# Altium project MainBoard.PrjPCB
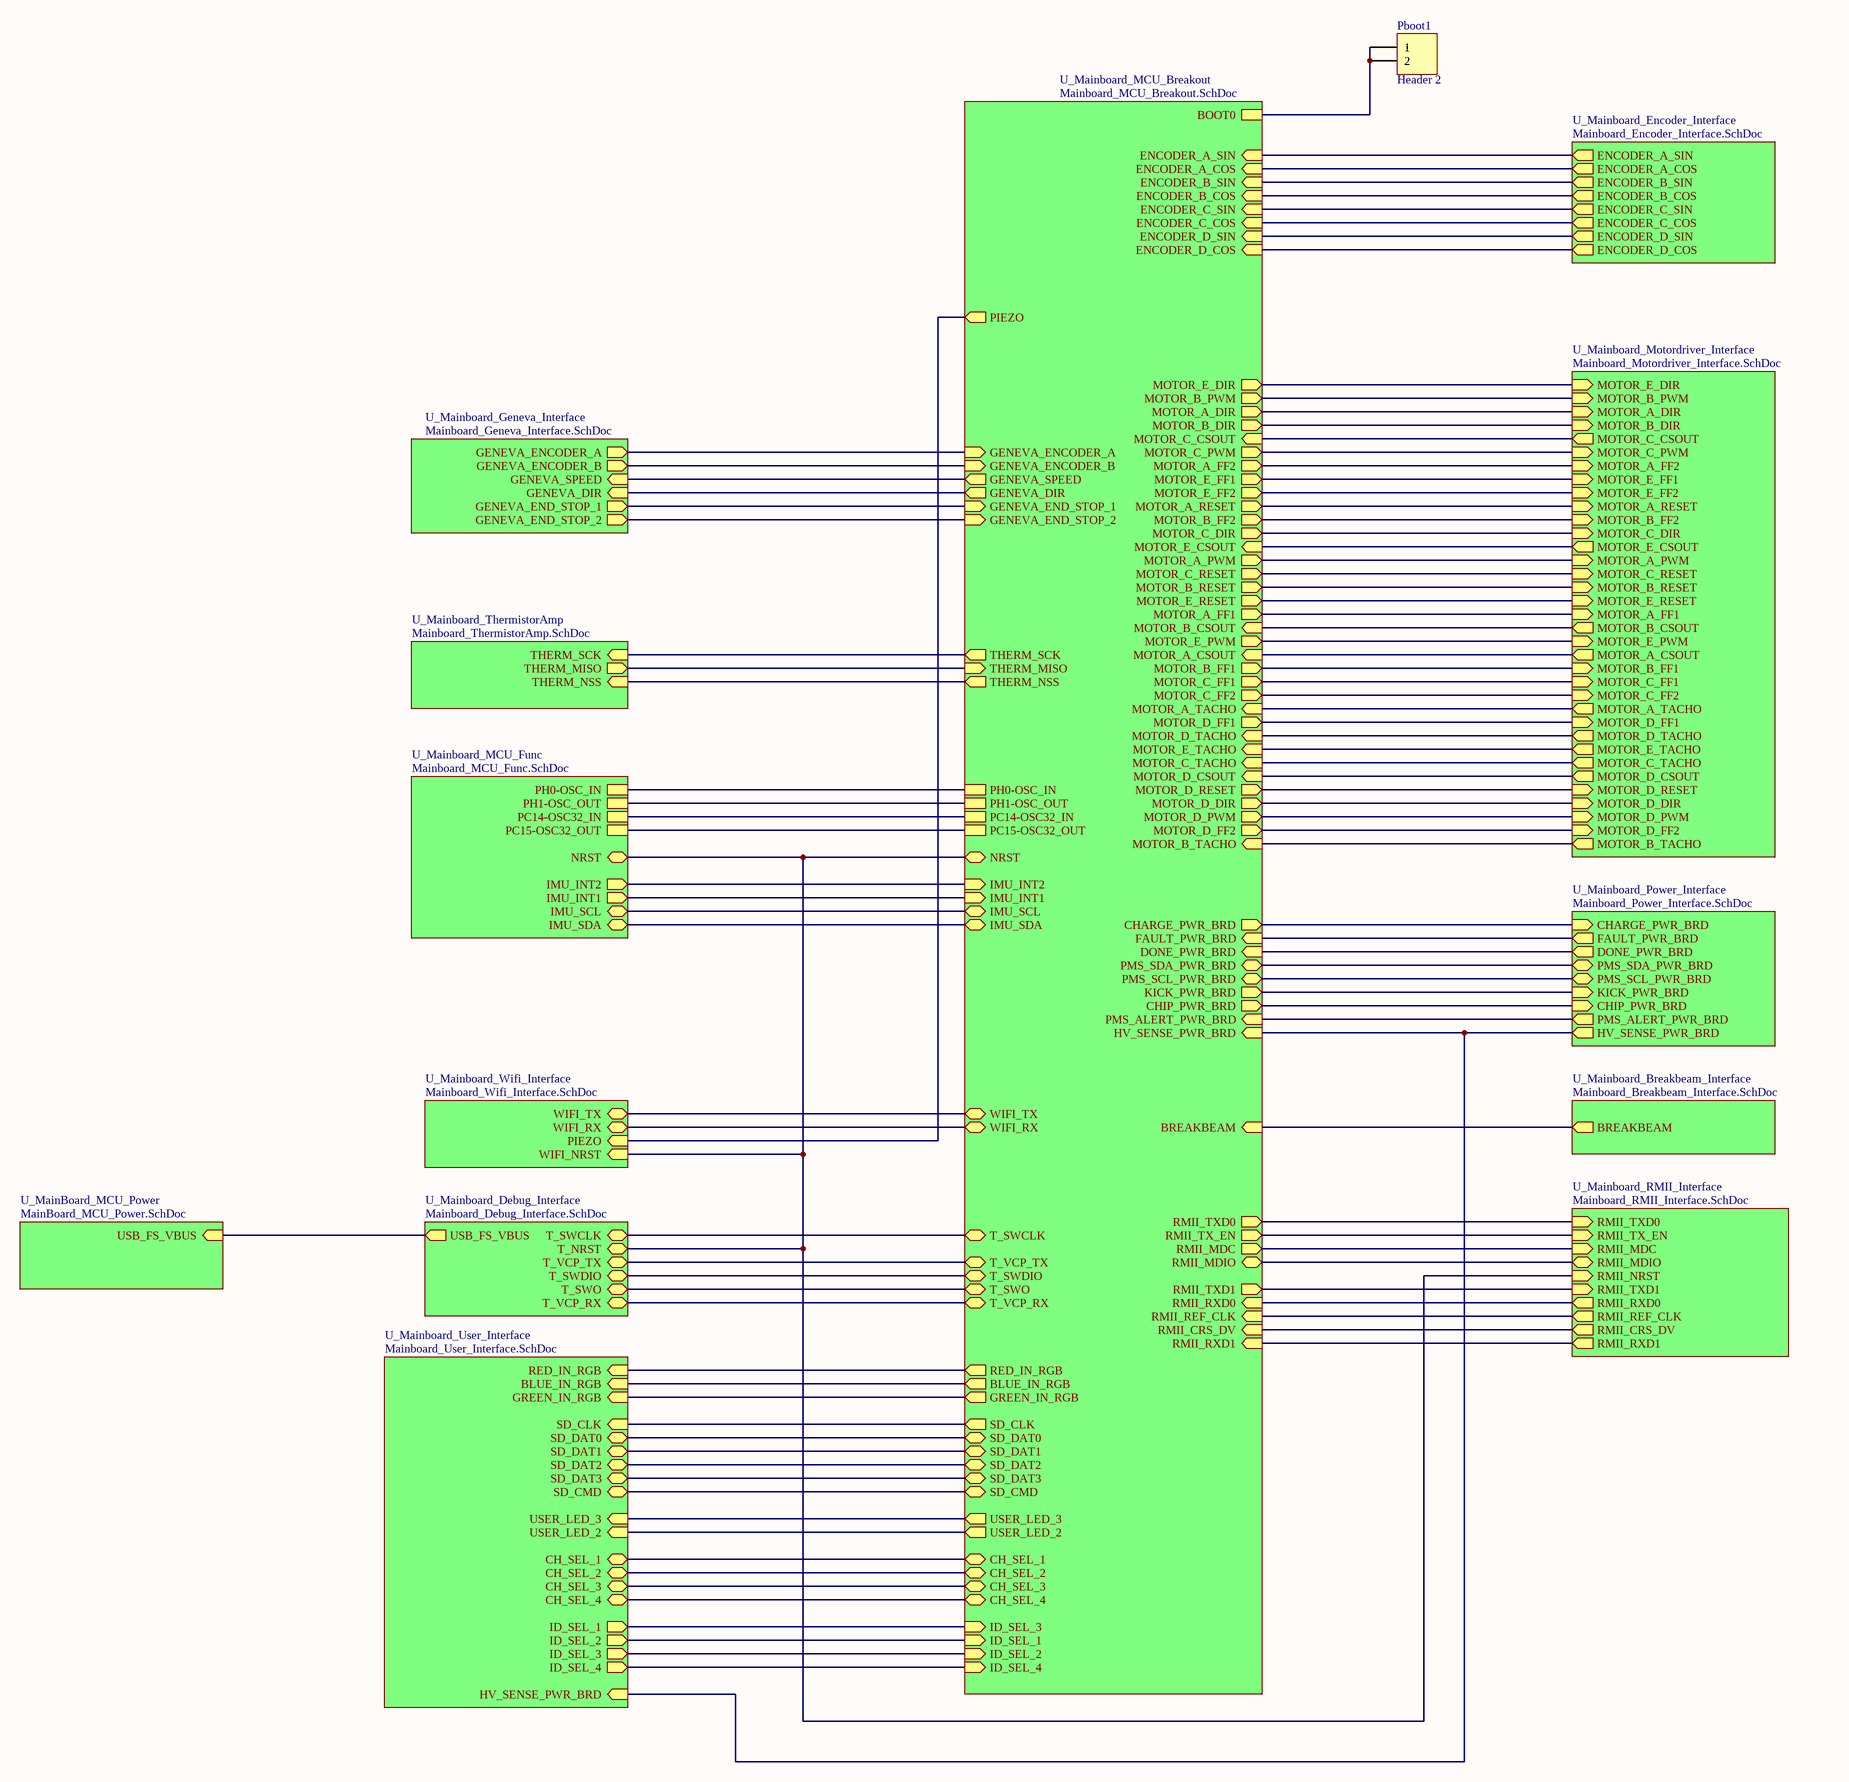
[diagram p0: MainBoard_Top.SchDoc]
4 sheets, 129 parts. Net scope: hierarchical (ports join the sheet entries above them; power ports are global).
Board file: MainBoard_Layout_V2.PcbDoc
Sheets:
  MainBoard_Top.SchDoc
    U_Mainboard_Encoder_Interface = Mainboard_Encoder_Interface.SchDoc
    U_Mainboard_RMII_Interface = Mainboard_RMII_Interface.SchDoc
    U_Mainboard_MCU_Breakout = Mainboard_MCU_Breakout.SchDoc

## Sheet MainBoard_Top.SchDoc
size C

### Parts
Pboot1  Header 2  [HDR1X2]

### Sub-sheets
U_Mainboard_Breakbeam_Interface = Mainboard_Breakbeam_Interface.SchDoc (file not in this document): BREAKBEAM (out)
U_Mainboard_Debug_Interface = Mainboard_Debug_Interface.SchDoc (file not in this document): USB_FS_VBUS (out), T_SWCLK (bidir), T_NRST (bidir), T_VCP_TX (bidir), T_SWDIO (bidir), T_SWO (bidir), T_VCP_RX (bidir)
U_Mainboard_Encoder_Interface = Mainboard_Encoder_Interface.SchDoc: ENCODER_A_SIN (out), ENCODER_B_COS (out), ENCODER_C_COS (out), ENCODER_A_COS (out), ENCODER_D_SIN (out), ENCODER_D_COS (out), ENCODER_B_SIN (out), ENCODER_C_SIN (out)
U_Mainboard_Geneva_Interface = Mainboard_Geneva_Interface.SchDoc (file not in this document): GENEVA_SPEED (in), GENEVA_ENCODER_A (out), GENEVA_ENCODER_B (out), GENEVA_DIR (in), GENEVA_END_STOP_1 (out), GENEVA_END_STOP_2 (out)
U_Mainboard_MCU_Breakout = Mainboard_MCU_Breakout.SchDoc: BOOT0, T_SWCLK (bidir), T_VCP_TX (bidir), T_SWDIO (bidir), T_SWO (bidir), T_VCP_RX (bidir), RED_IN_RGB (out), BLUE_IN_RGB (out), GREEN_IN_RGB (out), SD_CLK (out), SD_DAT0 (bidir), SD_DAT1 (bidir), SD_DAT2 (bidir), SD_DAT3 (bidir), SD_CMD (bidir), CH_SEL_1 (bidir), CH_SEL_2 (bidir), CH_SEL_3 (bidir), CH_SEL_4 (bidir), ENCODER_A_SIN (in), ENCODER_A_COS (in), ENCODER_B_SIN (in), ENCODER_B_COS (in), ENCODER_C_SIN (in), ENCODER_C_COS (in), ENCODER_D_SIN (in), ENCODER_D_COS (in), USER_LED_3 (out), USER_LED_2 (out), PC15-OSC32_OUT, PC14-OSC32_IN, PH1-OSC_OUT, NRST (bidir), PH0-OSC_IN, IMU_INT2 (in), IMU_INT1 (in), BREAKBEAM (in), RMII_TXD0 (out), RMII_TX_EN (out), RMII_MDC (out), RMII_MDIO (bidir), RMII_TXD1 (out), RMII_RXD0 (in), RMII_REF_CLK (in), RMII_CRS_DV (in), RMII_RXD1 (in), HV_SENSE_PWR_BRD (in), PMS_ALERT_PWR_BRD (in), CHIP_PWR_BRD (out), KICK_PWR_BRD (out), PMS_SCL_PWR_BRD (bidir), PMS_SDA_PWR_BRD (bidir), DONE_PWR_BRD (in), FAULT_PWR_BRD (in), CHARGE_PWR_BRD (out), IMU_SDA (bidir), IMU_SCL (bidir), THERM_NSS (out), THERM_MISO (in), THERM_SCK (out), WIFI_RX (bidir), WIFI_TX (bidir), ID_SEL_3 (in), ID_SEL_1 (in), ID_SEL_2 (in), ID_SEL_4 (in), MOTOR_E_DIR (out), MOTOR_B_PWM (out), MOTOR_A_DIR (out), MOTOR_B_DIR (out), MOTOR_C_CSOUT (in), MOTOR_C_PWM (out), MOTOR_A_FF2 (out), MOTOR_E_FF1 (out), MOTOR_E_FF2 (out), MOTOR_A_RESET (out), MOTOR_B_FF2 (out), MOTOR_C_DIR (out), MOTOR_E_CSOUT (in), MOTOR_A_PWM (out), MOTOR_C_RESET (out), MOTOR_B_RESET (out), MOTOR_E_RESET (out), MOTOR_A_FF1 (out), MOTOR_B_CSOUT (in), MOTOR_E_PWM (out), MOTOR_A_CSOUT (in), MOTOR_B_FF1 (out), MOTOR_C_FF1 (out), MOTOR_C_FF2 (out), MOTOR_A_TACHO (in), MOTOR_D_FF1 (out), MOTOR_D_TACHO (in), MOTOR_E_TACHO (in), MOTOR_C_TACHO (in), MOTOR_D_CSOUT (in), MOTOR_D_RESET (out), MOTOR_D_DIR (out), MOTOR_D_PWM (out), MOTOR_D_FF2 (out), MOTOR_B_TACHO (in), GENEVA_ENCODER_B (in), GENEVA_ENCODER_A (in), GENEVA_SPEED (out), PIEZO (out), GENEVA_DIR (out), GENEVA_END_STOP_2 (in), GENEVA_END_STOP_1 (in)
U_Mainboard_MCU_Func = Mainboard_MCU_Func.SchDoc (file not in this document): NRST (bidir), IMU_SCL (bidir), IMU_SDA (bidir), IMU_INT1 (out), IMU_INT2 (out), PH0-OSC_IN, PH1-OSC_OUT, PC14-OSC32_IN, PC15-OSC32_OUT
U_MainBoard_MCU_Power = MainBoard_MCU_Power.SchDoc (file not in this document): USB_FS_VBUS (in)
U_Mainboard_Motordriver_Interface = Mainboard_Motordriver_Interface.SchDoc (file not in this document): MOTOR_E_DIR (in), MOTOR_B_PWM (in), MOTOR_A_DIR (in), MOTOR_B_DIR (in), MOTOR_C_CSOUT (out), MOTOR_C_PWM (in), MOTOR_A_FF2 (in), MOTOR_E_FF1 (in), MOTOR_E_FF2 (in), MOTOR_A_RESET (in), MOTOR_B_FF2 (in), MOTOR_C_DIR (in), MOTOR_E_CSOUT (out), MOTOR_A_PWM (in), MOTOR_C_RESET (in), MOTOR_B_RESET (in), MOTOR_E_RESET (in), MOTOR_A_FF1 (in), MOTOR_B_CSOUT (out), MOTOR_E_PWM (in), MOTOR_A_CSOUT (out), MOTOR_B_FF1 (in), MOTOR_C_FF1 (in), MOTOR_C_FF2 (in), MOTOR_A_TACHO (out), MOTOR_D_FF1 (in), MOTOR_D_TACHO (out), MOTOR_E_TACHO (out), MOTOR_C_TACHO (out), MOTOR_D_CSOUT (out), MOTOR_D_RESET (in), MOTOR_D_DIR (in), MOTOR_D_PWM (in), MOTOR_D_FF2 (in), MOTOR_B_TACHO (out)
U_Mainboard_Power_Interface = Mainboard_Power_Interface.SchDoc (file not in this document): CHARGE_PWR_BRD (in), FAULT_PWR_BRD (out), DONE_PWR_BRD (out), PMS_SDA_PWR_BRD (bidir), PMS_SCL_PWR_BRD (bidir), KICK_PWR_BRD (in), CHIP_PWR_BRD (in), PMS_ALERT_PWR_BRD (out), HV_SENSE_PWR_BRD (out)
U_Mainboard_RMII_Interface = Mainboard_RMII_Interface.SchDoc: RMII_TXD0 (in), RMII_TX_EN (in), RMII_RXD0 (out), RMII_REF_CLK (out), RMII_CRS_DV (out), RMII_MDC (in), RMII_MDIO (bidir), RMII_NRST (in), RMII_TXD1 (in), RMII_RXD1 (out)
U_Mainboard_ThermistorAmp = Mainboard_ThermistorAmp.SchDoc (file not in this document): THERM_NSS (in), THERM_MISO (out), THERM_SCK (in)
U_Mainboard_User_Interface = Mainboard_User_Interface.SchDoc (file not in this document): RED_IN_RGB (in), BLUE_IN_RGB (in), GREEN_IN_RGB (in), SD_CLK (in), SD_DAT0 (bidir), SD_DAT1 (bidir), SD_DAT2 (bidir), SD_DAT3 (bidir), SD_CMD (bidir), USER_LED_3 (in), USER_LED_2 (in), CH_SEL_1 (bidir), CH_SEL_2 (bidir), CH_SEL_3 (bidir), CH_SEL_4 (bidir), ID_SEL_1 (out), ID_SEL_2 (out), ID_SEL_3 (out), ID_SEL_4 (out), HV_SENSE_PWR_BRD (in)
U_Mainboard_Wifi_Interface = Mainboard_Wifi_Interface.SchDoc (file not in this document): WIFI_NRST (in), WIFI_TX (bidir), WIFI_RX (bidir), PIEZO (in)

### Nets
COS_A: sheet U_Mainboard_Encoder_Interface/ENCODER_A_COS, sheet U_Mainboard_MCU_Breakout/ENCODER_A_COS
COS_B: sheet U_Mainboard_Encoder_Interface/ENCODER_B_COS, sheet U_Mainboard_MCU_Breakout/ENCODER_B_COS
COS_C: sheet U_Mainboard_Encoder_Interface/ENCODER_C_COS, sheet U_Mainboard_MCU_Breakout/ENCODER_C_COS
COS_D: sheet U_Mainboard_Encoder_Interface/ENCODER_D_COS, sheet U_Mainboard_MCU_Breakout/ENCODER_D_COS
RMII_MDIO: sheet U_Mainboard_RMII_Interface/RMII_MDIO, sheet U_Mainboard_MCU_Breakout/RMII_MDIO
RMII_REF_CLK: sheet U_Mainboard_RMII_Interface/RMII_REF_CLK, sheet U_Mainboard_MCU_Breakout/RMII_REF_CLK
RMII_TX_EN: sheet U_Mainboard_RMII_Interface/RMII_TX_EN, sheet U_Mainboard_MCU_Breakout/RMII_TX_EN
RMII_TXD0: sheet U_Mainboard_RMII_Interface/RMII_TXD0, sheet U_Mainboard_MCU_Breakout/RMII_TXD0
RMII_TXD1: sheet U_Mainboard_RMII_Interface/RMII_TXD1, sheet U_Mainboard_MCU_Breakout/RMII_TXD1
SIN_A: sheet U_Mainboard_Encoder_Interface/ENCODER_A_SIN, sheet U_Mainboard_MCU_Breakout/ENCODER_A_SIN
SIN_B: sheet U_Mainboard_Encoder_Interface/ENCODER_B_SIN, sheet U_Mainboard_MCU_Breakout/ENCODER_B_SIN
SIN_C: sheet U_Mainboard_Encoder_Interface/ENCODER_C_SIN, sheet U_Mainboard_MCU_Breakout/ENCODER_C_SIN
SIN_D: sheet U_Mainboard_Encoder_Interface/ENCODER_D_SIN, sheet U_Mainboard_MCU_Breakout/ENCODER_D_SIN
NetPboot1_1: Pboot1.1 Pboot1.2 ; sheet U_Mainboard_MCU_Breakout/BOOT0
NetR63_2: sheet U_Mainboard_RMII_Interface/RMII_RXD0, sheet U_Mainboard_MCU_Breakout/RMII_RXD0
NetR64_2: sheet U_Mainboard_RMII_Interface/RMII_RXD1, sheet U_Mainboard_MCU_Breakout/RMII_RXD1
NetR66_2: sheet U_Mainboard_RMII_Interface/RMII_CRS_DV, sheet U_Mainboard_MCU_Breakout/RMII_CRS_DV
NetU9_13: sheet U_Mainboard_RMII_Interface/RMII_MDC, sheet U_Mainboard_MCU_Breakout/RMII_MDC
NetU9_15: sheet U_Mainboard_RMII_Interface/RMII_NRST, sheet U_Mainboard_Wifi_Interface/WIFI_NRST, sheet U_Mainboard_Debug_Interface/T_NRST, sheet U_Mainboard_MCU_Breakout/NRST, sheet U_Mainboard_MCU_Func/NRST
NetU12_2: sheet U_Mainboard_Power_Interface/FAULT_PWR_BRD, sheet U_Mainboard_MCU_Breakout/FAULT_PWR_BRD
NetU12_3: sheet U_Mainboard_Power_Interface/DONE_PWR_BRD, sheet U_Mainboard_MCU_Breakout/DONE_PWR_BRD
NetU12_4: sheet U_Mainboard_Motordriver_Interface/MOTOR_E_FF1, sheet U_Mainboard_MCU_Breakout/MOTOR_E_FF1
NetU12_5: sheet U_Mainboard_MCU_Breakout/IMU_INT1, sheet U_Mainboard_MCU_Func/IMU_INT1
NetU12_7: sheet U_Mainboard_MCU_Breakout/IMU_INT2, sheet U_Mainboard_MCU_Func/IMU_INT2
NetU12_8: sheet U_Mainboard_MCU_Breakout/PC14-OSC32_IN, sheet U_Mainboard_MCU_Func/PC14-OSC32_IN
NetU12_9: sheet U_Mainboard_MCU_Breakout/PC15-OSC32_OUT, sheet U_Mainboard_MCU_Func/PC15-OSC32_OUT
NetU12_10: sheet U_Mainboard_MCU_Breakout/IMU_SDA, sheet U_Mainboard_MCU_Func/IMU_SDA
NetU12_11: sheet U_Mainboard_MCU_Breakout/IMU_SCL, sheet U_Mainboard_MCU_Func/IMU_SCL
NetU12_12: sheet U_Mainboard_Motordriver_Interface/MOTOR_E_RESET, sheet U_Mainboard_MCU_Breakout/MOTOR_E_RESET
NetU12_21: sheet U_Mainboard_Power_Interface/HV_SENSE_PWR_BRD, sheet U_Mainboard_MCU_Breakout/HV_SENSE_PWR_BRD, sheet U_Mainboard_User_Interface/HV_SENSE_PWR_BRD
NetU12_22: sheet U_Mainboard_Motordriver_Interface/MOTOR_E_FF2, sheet U_Mainboard_MCU_Breakout/MOTOR_E_FF2
NetU12_23: sheet U_Mainboard_MCU_Breakout/PH0-OSC_IN, sheet U_Mainboard_MCU_Func/PH0-OSC_IN
NetU12_24: sheet U_Mainboard_MCU_Breakout/PH1-OSC_OUT, sheet U_Mainboard_MCU_Func/PH1-OSC_OUT
NetU12_26: sheet U_Mainboard_Motordriver_Interface/MOTOR_E_CSOUT, sheet U_Mainboard_MCU_Breakout/MOTOR_E_CSOUT
NetU12_34: sheet U_Mainboard_Wifi_Interface/WIFI_TX, sheet U_Mainboard_MCU_Breakout/WIFI_TX
NetU12_37: sheet U_Mainboard_Motordriver_Interface/MOTOR_D_CSOUT, sheet U_Mainboard_MCU_Breakout/MOTOR_D_CSOUT
NetU12_40: sheet U_Mainboard_MCU_Breakout/THERM_NSS, sheet U_Mainboard_ThermistorAmp/THERM_NSS
NetU12_41: sheet U_Mainboard_MCU_Breakout/THERM_SCK, sheet U_Mainboard_ThermistorAmp/THERM_SCK
NetU12_42: sheet U_Mainboard_MCU_Breakout/THERM_MISO, sheet U_Mainboard_ThermistorAmp/THERM_MISO
NetU12_46: sheet U_Mainboard_Motordriver_Interface/MOTOR_C_CSOUT, sheet U_Mainboard_MCU_Breakout/MOTOR_C_CSOUT
NetU12_47: sheet U_Mainboard_Motordriver_Interface/MOTOR_E_TACHO, sheet U_Mainboard_MCU_Breakout/MOTOR_E_TACHO
NetU12_48: sheet U_Mainboard_Motordriver_Interface/MOTOR_D_RESET, sheet U_Mainboard_MCU_Breakout/MOTOR_D_RESET
NetU12_49: sheet U_Mainboard_Motordriver_Interface/MOTOR_B_CSOUT, sheet U_Mainboard_MCU_Breakout/MOTOR_B_CSOUT
NetU12_50: sheet U_Mainboard_Motordriver_Interface/MOTOR_A_CSOUT, sheet U_Mainboard_MCU_Breakout/MOTOR_A_CSOUT
NetU12_53: sheet U_Mainboard_MCU_Breakout/RED_IN_RGB, sheet U_Mainboard_User_Interface/RED_IN_RGB
NetU12_54: sheet U_Mainboard_MCU_Breakout/BLUE_IN_RGB, sheet U_Mainboard_User_Interface/BLUE_IN_RGB
NetU12_55: sheet U_Mainboard_MCU_Breakout/GREEN_IN_RGB, sheet U_Mainboard_User_Interface/GREEN_IN_RGB
NetU12_56: sheet U_Mainboard_MCU_Breakout/CH_SEL_1, sheet U_Mainboard_User_Interface/CH_SEL_1
NetU12_57: sheet U_Mainboard_MCU_Breakout/CH_SEL_2, sheet U_Mainboard_User_Interface/CH_SEL_2
NetU12_58: sheet U_Mainboard_MCU_Breakout/CH_SEL_3, sheet U_Mainboard_User_Interface/CH_SEL_3
NetU12_59: sheet U_Mainboard_MCU_Breakout/CH_SEL_4, sheet U_Mainboard_User_Interface/CH_SEL_4
NetU12_60: sheet U_Mainboard_MCU_Breakout/USER_LED_2, sheet U_Mainboard_User_Interface/USER_LED_2
NetU12_63: sheet U_Mainboard_MCU_Breakout/USER_LED_3, sheet U_Mainboard_User_Interface/USER_LED_3
NetU12_64: sheet U_Mainboard_MCU_Breakout/GENEVA_ENCODER_A, sheet U_Mainboard_Geneva_Interface/GENEVA_ENCODER_A
NetU12_65: sheet U_Mainboard_Motordriver_Interface/MOTOR_D_DIR, sheet U_Mainboard_MCU_Breakout/MOTOR_D_DIR
NetU12_66: sheet U_Mainboard_Motordriver_Interface/MOTOR_D_TACHO, sheet U_Mainboard_MCU_Breakout/MOTOR_D_TACHO
NetU12_67: sheet U_Mainboard_Motordriver_Interface/MOTOR_D_PWM, sheet U_Mainboard_MCU_Breakout/MOTOR_D_PWM
NetU12_68: sheet U_Mainboard_Motordriver_Interface/MOTOR_D_FF1, sheet U_Mainboard_MCU_Breakout/MOTOR_D_FF1
NetU12_69: sheet U_Mainboard_Motordriver_Interface/MOTOR_E_PWM, sheet U_Mainboard_MCU_Breakout/MOTOR_E_PWM
NetU12_75: sheet U_Mainboard_Motordriver_Interface/MOTOR_C_TACHO, sheet U_Mainboard_MCU_Breakout/MOTOR_C_TACHO
NetU12_76: sheet U_Mainboard_Motordriver_Interface/MOTOR_C_PWM, sheet U_Mainboard_MCU_Breakout/MOTOR_C_PWM
NetU12_77: sheet U_Mainboard_Debug_Interface/T_VCP_TX, sheet U_Mainboard_MCU_Breakout/T_VCP_TX
NetU12_78: sheet U_Mainboard_Debug_Interface/T_VCP_RX, sheet U_Mainboard_MCU_Breakout/T_VCP_RX
NetU12_79: sheet U_Mainboard_Motordriver_Interface/MOTOR_D_FF2, sheet U_Mainboard_MCU_Breakout/MOTOR_D_FF2
NetU12_80: sheet U_Mainboard_Motordriver_Interface/MOTOR_C_RESET, sheet U_Mainboard_MCU_Breakout/MOTOR_C_RESET
NetU12_81: sheet U_Mainboard_Motordriver_Interface/MOTOR_B_PWM, sheet U_Mainboard_MCU_Breakout/MOTOR_B_PWM
NetU12_82: sheet U_Mainboard_Motordriver_Interface/MOTOR_B_TACHO, sheet U_Mainboard_MCU_Breakout/MOTOR_B_TACHO
NetU12_85: sheet U_Mainboard_Motordriver_Interface/MOTOR_C_FF1, sheet U_Mainboard_MCU_Breakout/MOTOR_C_FF1
NetU12_86: sheet U_Mainboard_Motordriver_Interface/MOTOR_C_FF2, sheet U_Mainboard_MCU_Breakout/MOTOR_C_FF2
NetU12_87: sheet U_Mainboard_Motordriver_Interface/MOTOR_B_RESET, sheet U_Mainboard_MCU_Breakout/MOTOR_B_RESET
NetU12_88: sheet U_Mainboard_Motordriver_Interface/MOTOR_B_FF1, sheet U_Mainboard_MCU_Breakout/MOTOR_B_FF1
NetU12_89: sheet U_Mainboard_Motordriver_Interface/MOTOR_B_FF2, sheet U_Mainboard_MCU_Breakout/MOTOR_B_FF2
NetU12_90: sheet U_Mainboard_Motordriver_Interface/MOTOR_A_RESET, sheet U_Mainboard_MCU_Breakout/MOTOR_A_RESET
NetU12_91: sheet U_Mainboard_Motordriver_Interface/MOTOR_A_FF1, sheet U_Mainboard_MCU_Breakout/MOTOR_A_FF1
NetU12_92: sheet U_Mainboard_Motordriver_Interface/MOTOR_A_FF2, sheet U_Mainboard_MCU_Breakout/MOTOR_A_FF2
NetU12_93: sheet U_Mainboard_Breakbeam_Interface/BREAKBEAM, sheet U_Mainboard_MCU_Breakout/BREAKBEAM
NetU12_96: sheet U_Mainboard_MCU_Breakout/GENEVA_SPEED, sheet U_Mainboard_Geneva_Interface/GENEVA_SPEED
NetU12_97: sheet U_Mainboard_MCU_Breakout/GENEVA_ENCODER_B, sheet U_Mainboard_Geneva_Interface/GENEVA_ENCODER_B
NetU12_98: sheet U_Mainboard_MCU_Breakout/SD_DAT0, sheet U_Mainboard_User_Interface/SD_DAT0
NetU12_99: sheet U_Mainboard_MCU_Breakout/SD_DAT1, sheet U_Mainboard_User_Interface/SD_DAT1
NetU12_100: sheet U_Mainboard_Motordriver_Interface/MOTOR_A_TACHO, sheet U_Mainboard_MCU_Breakout/MOTOR_A_TACHO
NetU12_101: sheet U_Mainboard_Motordriver_Interface/MOTOR_E_DIR, sheet U_Mainboard_MCU_Breakout/MOTOR_E_DIR
NetU12_102: sheet U_Mainboard_Motordriver_Interface/MOTOR_C_DIR, sheet U_Mainboard_MCU_Breakout/MOTOR_C_DIR
NetU12_103: sheet U_Mainboard_Motordriver_Interface/MOTOR_B_DIR, sheet U_Mainboard_MCU_Breakout/MOTOR_B_DIR
NetU12_104: sheet U_Mainboard_Motordriver_Interface/MOTOR_A_DIR, sheet U_Mainboard_MCU_Breakout/MOTOR_A_DIR
NetU12_105: sheet U_Mainboard_Debug_Interface/T_SWDIO, sheet U_Mainboard_MCU_Breakout/T_SWDIO
NetU12_109: sheet U_Mainboard_Debug_Interface/T_SWCLK, sheet U_Mainboard_MCU_Breakout/T_SWCLK
NetU12_110: sheet U_Mainboard_Motordriver_Interface/MOTOR_A_PWM, sheet U_Mainboard_MCU_Breakout/MOTOR_A_PWM
NetU12_111: sheet U_Mainboard_MCU_Breakout/SD_DAT2, sheet U_Mainboard_User_Interface/SD_DAT2
NetU12_112: sheet U_Mainboard_MCU_Breakout/SD_DAT3, sheet U_Mainboard_User_Interface/SD_DAT3
NetU12_113: sheet U_Mainboard_MCU_Breakout/SD_CLK, sheet U_Mainboard_User_Interface/SD_CLK
NetU12_114: sheet U_Mainboard_Wifi_Interface/WIFI_RX, sheet U_Mainboard_MCU_Breakout/WIFI_RX
NetU12_115: sheet U_Mainboard_MCU_Breakout/ID_SEL_1, sheet U_Mainboard_User_Interface/ID_SEL_2
NetU12_116: sheet U_Mainboard_MCU_Breakout/SD_CMD, sheet U_Mainboard_User_Interface/SD_CMD
NetU12_117: sheet U_Mainboard_MCU_Breakout/ID_SEL_3, sheet U_Mainboard_User_Interface/ID_SEL_1
NetU12_118: sheet U_Mainboard_MCU_Breakout/ID_SEL_2, sheet U_Mainboard_User_Interface/ID_SEL_3
NetU12_119: sheet U_Mainboard_MCU_Breakout/ID_SEL_4, sheet U_Mainboard_User_Interface/ID_SEL_4
NetU12_127: sheet U_Mainboard_MCU_Breakout/GENEVA_END_STOP_2, sheet U_Mainboard_Geneva_Interface/GENEVA_END_STOP_2
NetU12_128: sheet U_Mainboard_MCU_Breakout/GENEVA_END_STOP_1, sheet U_Mainboard_Geneva_Interface/GENEVA_END_STOP_1
NetU12_129: sheet U_Mainboard_MCU_Breakout/GENEVA_DIR, sheet U_Mainboard_Geneva_Interface/GENEVA_DIR
NetU12_133: sheet U_Mainboard_Debug_Interface/T_SWO, sheet U_Mainboard_MCU_Breakout/T_SWO
NetU12_134: sheet U_Mainboard_Wifi_Interface/PIEZO, sheet U_Mainboard_MCU_Breakout/PIEZO
NetU12_135: sheet U_Mainboard_Power_Interface/PMS_ALERT_PWR_BRD, sheet U_Mainboard_MCU_Breakout/PMS_ALERT_PWR_BRD
NetU12_136: sheet U_Mainboard_Power_Interface/PMS_SCL_PWR_BRD, sheet U_Mainboard_MCU_Breakout/PMS_SCL_PWR_BRD
NetU12_137: sheet U_Mainboard_Power_Interface/PMS_SDA_PWR_BRD, sheet U_Mainboard_MCU_Breakout/PMS_SDA_PWR_BRD
NetU12_139: sheet U_Mainboard_Power_Interface/CHIP_PWR_BRD, sheet U_Mainboard_MCU_Breakout/CHIP_PWR_BRD
NetU12_140: sheet U_Mainboard_Power_Interface/KICK_PWR_BRD, sheet U_Mainboard_MCU_Breakout/KICK_PWR_BRD
NetU12_142: sheet U_Mainboard_Power_Interface/CHARGE_PWR_BRD, sheet U_Mainboard_MCU_Breakout/CHARGE_PWR_BRD
(unnamed): sheet U_MainBoard_MCU_Power/USB_FS_VBUS, sheet U_Mainboard_Debug_Interface/USB_FS_VBUS

### Library data of the parts
Pboot1 = Header 2: Header, 2-Pin; LatestRevisionDate: 17-Jul-2002; LatestRevisionNote: Re-released for DXP Platform.; Publisher: Altium Limited

## Sheet Mainboard_Encoder_Interface.SchDoc
size 381 x 254 mm
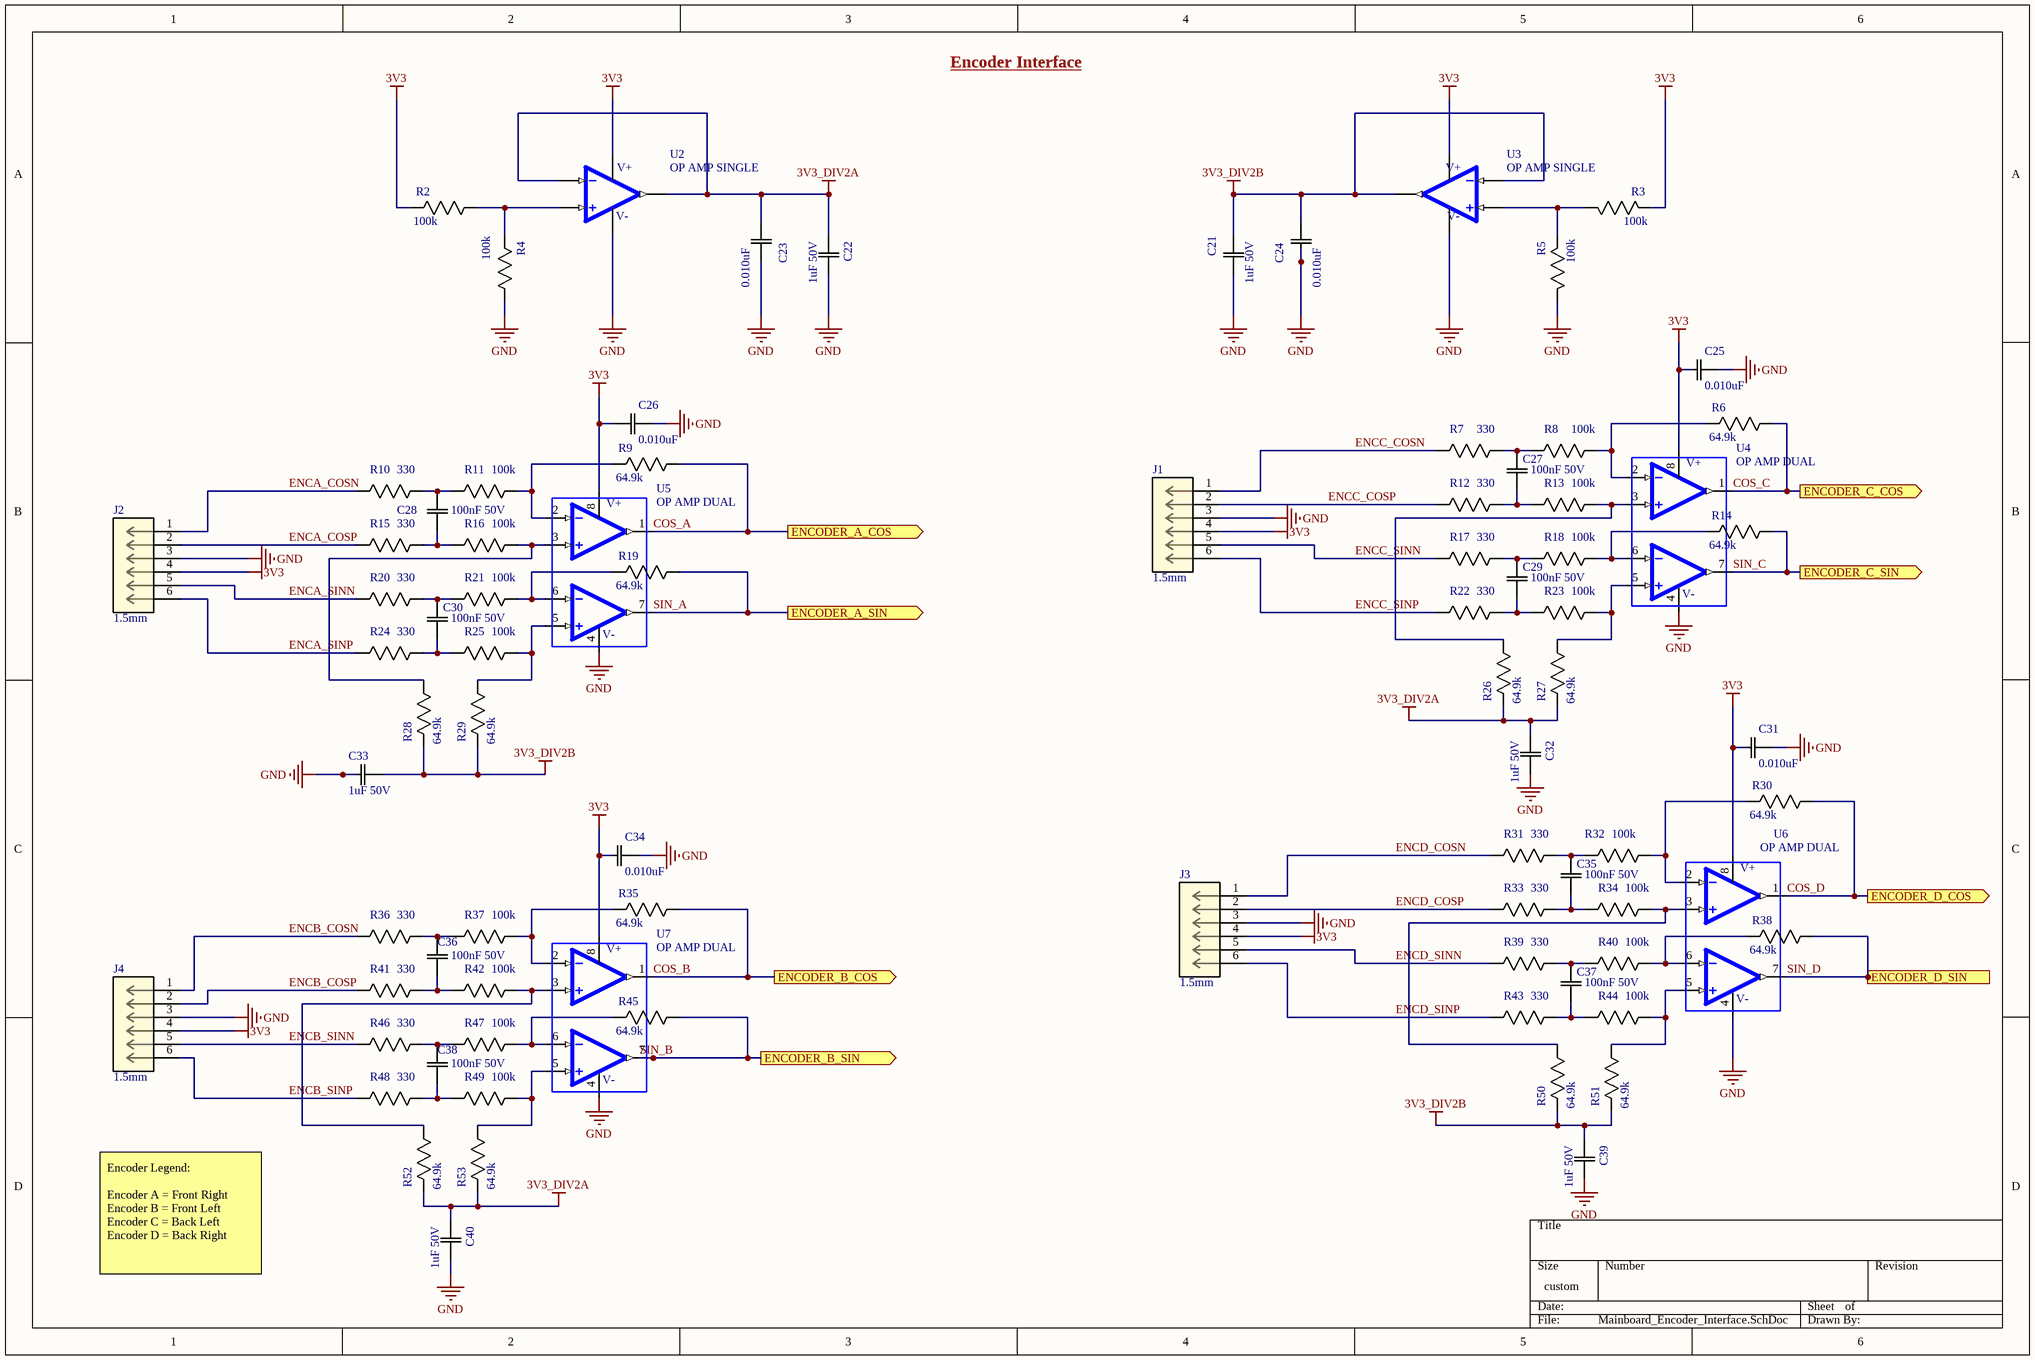
[diagram p1: Mainboard_Encoder_Interface.SchDoc]

### Parts
C21  1uF 50V  [0805]
C22  1uF 50V  [0805]
C23  0.010uF  [0805]
C24  0.010uF  [0805]
C25  0.010uF  [0805]
C26  0.010uF  [0805]
C27  100nF 50V  [0805]
C28  100nF 50V  [0805]
C29  100nF 50V  [0805]
C30  100nF 50V  [0805]
C31  0.010uF  [0805]
C32  1uF 50V  [0805]
C33  1uF 50V  [0805]
C34  0.010uF  [0805]
C35  100nF 50V  [0805]
C36  100nF 50V  [0805]
C37  100nF 50V  [0805]
C38  100nF 50V  [0805]
C39  1uF 50V  [0805]
C40  1uF 50V  [0805]
J1  1.5mm  [6POS JST]
J2  1.5mm  [6POS JST]
J3  1.5mm  [6POS JST]
J4  1.5mm  [6POS JST]
R2  100k  [0805]
R3  100k  [0805]
R4  100k  [0805]
R5  100k  [0805]
R6  64.9k  [0805]
R7  330  [0805]
R8  100k  [0805]
R9  64.9k  [0805]
R10  330  [0805]
R11  100k  [0805]
R12  330  [0805]
R13  100k  [0805]
R14  64.9k  [0805]
R15  330  [0805]
R16  100k  [0805]
R17  330  [0805]
R18  100k  [0805]
R19  64.9k  [0805]
R20  330  [0805]
R21  100k  [0805]
R22  330  [0805]
R23  100k  [0805]
R24  330  [0805]
R25  100k  [0805]
R26  64.9k  [0805]
R27  64.9k  [0805]
R28  64.9k  [0805]
R29  64.9k  [0805]
R30  64.9k  [0805]
R31  330  [0805]
R32  100k  [0805]
R33  330  [0805]
R34  100k  [0805]
R35  64.9k  [0805]
R36  330  [0805]
R37  100k  [0805]
R38  64.9k  [0805]
R39  330  [0805]
R40  100k  [0805]
R41  330  [0805]
R42  100k  [0805]
R43  330  [0805]
R44  100k  [0805]
R45  64.9k  [0805]
R46  330  [0805]
R47  100k  [0805]
R48  330  [0805]
R49  100k  [0805]
R50  64.9k  [0805]
R51  64.9k  [0805]
R52  64.9k  [0805]
R53  64.9k  [0805]
U2  OP AMP SINGLE  [SOT95P280X145-5N]
U3  OP AMP SINGLE  [SOT95P280X145-5N]
U4  OP AMP DUAL  [8-MSOP]
U5  OP AMP DUAL  [8-MSOP]
U6  OP AMP DUAL  [8-MSOP]
U7  OP AMP DUAL  [8-MSOP]

### Ports
ENCODER_A_COS (out), ENCODER_A_SIN (out), ENCODER_B_COS (out), ENCODER_B_SIN (out), ENCODER_C_COS (out), ENCODER_C_SIN (out), ENCODER_D_COS (out), ENCODER_D_SIN (out)

### Nets
3V3: C25.1(C1) C26.1(C1) C31.1(C1) C34.1(C1) J1.4 J2.4 J3.4 J4.4 R2.2(R2) R3.2(R2) U2.5(V+) U3.5(V+) U4.8(V+) U5.8(V+) U6.8(V+) U7.8(V+)
3V3_DIV2A: C22.1(C1) C23.1(C1) C32.1(C1) C40.1(C1) R26.2(R2) R27.2(R2) R52.2(R2) R53.2(R2) U2.1(OUT) U2.4(IN-)
3V3_DIV2B: C21.1(C1) C24.1(C1) C33.2(C2) C39.1(C1) R28.2(R2) R29.2(R2) R50.2(R2) R51.2(R2) U3.1(OUT) U3.4(IN-)
GND: C21.2(C2) C22.2(C2) C23.2(C2) C24.2(C2) C25.2(C2) C26.2(C2) C31.2(C2) C32.2(C2) C33.1(C1) C34.2(C2) C39.2(C2) C40.2(C2) J1.3 J2.3 J3.3 J4.3 R4.1(R1) R5.1(R1) U2.2(V-) U3.2(V-) U4.4(V-) U5.4(V-) U6.4(V-) U7.4(V-)
COS_A: R9.1(R1) U5.1(OUTA) ; port ENCODER_A_COS
COS_B: R35.1(R1) U7.1(OUTA) ; port ENCODER_B_COS
COS_C: R6.1(R1) U4.1(OUTA) ; port ENCODER_C_COS
COS_D: R30.1(R1) U6.1(OUTA) ; port ENCODER_D_COS
ENCA_COSN: J2.1 R10.2(R2)
ENCA_COSP: J2.2 R15.2(R2)
ENCA_SINN: J2.5 R20.2(R2)
ENCA_SINP: J2.6 R24.2(R2)
ENCB_COSN: J4.1 R36.2(R2)
ENCB_COSP: J4.2 R41.2(R2)
ENCB_SINN: J4.5 R46.2(R2)
ENCB_SINP: J4.6 R48.2(R2)
ENCC_COSN: J1.1 R7.2(R2)
ENCC_COSP: J1.2 R12.2(R2)
ENCC_SINN: J1.5 R17.2(R2)
ENCC_SINP: J1.6 R22.2(R2)
ENCD_COSN: J3.1 R31.2(R2)
ENCD_COSP: J3.2 R33.2(R2)
ENCD_SINN: J3.5 R39.2(R2)
ENCD_SINP: J3.6 R43.2(R2)
SIN_A: R19.1(R1) U5.7(OUTB) ; port ENCODER_A_SIN
SIN_B: R45.1(R1) U7.7(OUTB) ; port ENCODER_B_SIN
SIN_C: R14.1(R1) U4.7(OUTB) ; port ENCODER_C_SIN
SIN_D: R38.1(R1) U6.7(OUTB) ; port ENCODER_D_SIN
NetC27_1: C27.1(C1) R7.1(R1) R8.2(R2)
NetC27_2: C27.2(C2) R12.1(R1) R13.2(R2)
NetC28_1: C28.1(C1) R10.1(R1) R11.2(R2)
NetC28_2: C28.2(C2) R15.1(R1) R16.2(R2)
NetC29_1: C29.1(C1) R17.1(R1) R18.2(R2)
NetC29_2: C29.2(C2) R22.1(R1) R23.2(R2)
NetC30_1: C30.1(C1) R20.1(R1) R21.2(R2)
NetC30_2: C30.2(C2) R24.1(R1) R25.2(R2)
NetC35_1: C35.1(C1) R31.1(R1) R32.2(R2)
NetC35_2: C35.2(C2) R33.1(R1) R34.2(R2)
NetC36_1: C36.1(C1) R36.1(R1) R37.2(R2)
NetC36_2: C36.2(C2) R41.1(R1) R42.2(R2)
NetC37_1: C37.1(C1) R39.1(R1) R40.2(R2)
NetC37_2: C37.2(C2) R43.1(R1) R44.2(R2)
NetC38_1: C38.1(C1) R46.1(R1) R47.2(R2)
NetC38_2: C38.2(C2) R48.1(R1) R49.2(R2)
NetR2_1: R2.1(R1) R4.2(R2) U2.3(IN+)
NetR3_1: R3.1(R1) R5.2(R2) U3.3(IN+)
NetR6_2: R6.2(R2) R8.1(R1) U4.2(INA-)
NetR9_2: R9.2(R2) R11.1(R1) U5.2(INA-)
NetR13_1: R13.1(R1) R26.1(R1) U4.3(INA+)
NetR14_2: R14.2(R2) R18.1(R1) U4.6(INB-)
NetR16_1: R16.1(R1) R28.1(R1) U5.3(INA+)
NetR19_2: R19.2(R2) R21.1(R1) U5.6(INB-)
NetR23_1: R23.1(R1) R27.1(R1) U4.5(INB+)
NetR25_1: R25.1(R1) R29.1(R1) U5.5(INB+)
NetR30_2: R30.2(R2) R32.1(R1) U6.2(INA-)
NetR34_1: R34.1(R1) R50.1(R1) U6.3(INA+)
NetR35_2: R35.2(R2) R37.1(R1) U7.2(INA-)
NetR38_2: R38.2(R2) R40.1(R1) U6.6(INB-)
NetR42_1: R42.1(R1) R52.1(R1) U7.3(INA+)
NetR44_1: R44.1(R1) R51.1(R1) U6.5(INB+)
NetR45_2: R45.2(R2) R47.1(R1) U7.6(INB-)
NetR49_1: R49.1(R1) R53.1(R1) U7.5(INB+)

### Notes on the sheet
- Encoder Interface
- Encoder Legend:
  Encoder A = Front Right
  Encoder B = Front Left
  Encoder C = Back Left
  Encoder D = Back Right

### Library data of the parts
C21 C22 C32 C33 C39 C40 = CAP 1uF 50V: CAP CER 1UF 50V X7R 0805; Tolerance: 10%; Package: 0805; Value: 1uF; Rating: 50V; Temperature Coefficient: X7R; Operating Temperature: -55°C ~ 125°C
C23-C26 C31 C34 = CAP 0.010uF 50V: CAP CER 0.010UF 50V X7R 0603/0805; Tolerance: 10%; Package: 0603/0805; Value: 0.010uF; Rating: 50V; Temperature Coefficient: X7R; Operating Temperature: -55°C ~ 125°C
C27-C30 C35-C38 = CAP 100nF 50V: CAP CER 0.1UF 50V X7R 0805; Tolerance: 10%; Package: 0805; Value: 100nF; Rating: 50V
J1-J4 = CN 6POS JST RA: Conn Shrouded Header HDR 6 POS 1.5mm Solder RA Thru-Hole Box; Manufacturer: JST; Manufacturer Part Number: S6B-ZR(LF)(SN); Body Plating: Tin; Number of Positions: 6; Current Rating: 1A; Connector Type: Header,Male Pin; Contact Resistance: 30mR; Voltage Rating: 50V; Gender: Male; Insulation Resistance: 500MR; Panel Thickness: 3.5mm; Supplier 1: Digi-Key; RoHS: Yes; Category: Headers and Wire Housings; Stock 1: 14808; Mount: Through Hole; Number of Pins: 6; Color: White; Contact Plating: Tin,Copper; Contact Material: Brass,Tin,Copper; Housing Color: Beige; Housing Material: Polyamide; Material: Nylon; Contact Shape: Circular; Insulation Material: Nylon; Insulation Color: Natural; Min Operating Temperature: -25°C; Max Operating Temperature: 85°C; Number of Rows: 1; Packaging: Bulk; Termination: Solder; Fastening Type: Detent; Number of Contacts: 6; Max Voltage Rating (AC): 50V; Max Current Rating: 1A; Orientation: Right Angle; Voltage Rating (AC): 50V; Voltage Rating (DC): 50V; Length: 10.5mm; Width: 3.5mm; Height: 7.2mm; Pitch: 1.5mm; Depth: 6mm; Lead Pitch: 1.5mm; Contact Mating Length: 0.094inch; Lead Free: Lead Free; Flammability Rating: UL94 V-0; REACH SVHC: No SVHC; ComponentLink1URL: https://datasheet.ciiva.com/8052/80556-8052225.pdf?src-supplier=Element14; ComponentLink1Description: https://datasheet.ciiva.com/8052/80556-8052225.pdf?src-supplier=Element14; ComponentLink2URL: https://datasheet.ciiva.com/25617/0900766b81147f94-25617345.pdf?src-supplier=RSComponents; ComponentLink2Description: https://datasheet.ciiva.com/25617/0900766b81147f94-25617345.pdf?src-supplier=RSComponents; ComponentLink3URL: https://datasheet.ciiva.com/11752/0900766b8082f593-11752194.pdf?src-supplier=RSComponents; ComponentLink3Description: https://datasheet.ciiva.com/11752/0900766b8082f593-11752194.pdf?src-supplier=RSComponents; ComponentLink4URL: https://datasheet.ciiva.com/26894/getdatasheetpartid-642095-26894637.pdf?src-supplier=Verical; ComponentLink4Description: https://datasheet.ciiva.com/26894/getdatasheetpartid-642095-26894637.pdf?src-supplier=Verical; ComponentLink5URL: https://datasheet.ciiva.com/712/ezh-712560.pdf?src-supplier=Digi-Key; ComponentLink5Description: https://datasheet.ciiva.com/712/ezh-712560.pdf?src-supplier=Digi-Key; ComponentLink6URL: https://datasheet.ciiva.com/16484/s6b-zrlfsn-16484554.pdf?src-supplier=Future+Electronics; ComponentLink6Description: https://datasheet.ciiva.com/16484/s6b-zrlfsn-16484554.pdf?src-supplier=Future+Electronics; Supplier Part Number 1: 455-1673-ND
R2-R5 R8 R11 R13 R16 R18 R21 R23 R25 R32 R34 R37 R40 R42 R44 R47 R49 = RES 100k 1/8W - 1%: RES SMD 100K OHM 1% 1/8W 0805; Power (Watts): 0.125W; Package: 0805; Value: 100k; Tolerance: 1%
R6 R9 R14 R19 R26-R30 R35 R38 R45 R50-R53 = RES 64.9k 1/8W: RES SMD 64.9K OHM 1% 1/8W 0805; Power (Watts): 0.125W; Package: 0805; Value: 64.9k; Tolerance: 1%; ComponentLink1Description: digikey; ComponentLink1URL: https://www.digikey.ca/en/products/detail/yageo/RC0805FR-0764K9L/728090
R7 R10 R12 R15 R17 R20 R22 R24 R31 R33 R36 R39 R41 R43 R46 R48 = RES 330.0 1/8W - 1%: RES SMD 330 OHM 1% 1/8W 0805; Rating: 0.125W; Package: 0805; Value: 330; Tolerance: 1%
U2 U3 = OP AMP SINGLE: ANALOG DEVICES - ADA4505-1ARJZ-R7 - IC, AMPLIF. OPER., R-R, CMOS, SOT23-5; Min Supply Voltage: 1.8V; Max Supply Voltage: 5V; Min Dual Supply Voltage: 900mV; Max Dual Supply Voltage: 2.5V; Voltage Gain: 120dB; Common Mode Rejection Ratio: 105dB; Gain Bandwidth Product: 50kHz; Slew Rate: 0.006V/µs; Operating Supply Voltage: 3V; Number of Circuits: 1; Input Bias Current: 500nA; Input Offset Voltage (Vos): 3mV; Operating Supply Current: 9uA; Output Current per Channel: 40mA; Power Supply Rejection Ratio (PSRR): 110dB; Input Capacitance: 4.7pF; Supplier 1: Digi-Key; Manufacturer: Analog Devices; Manufacturer Part Number: ADA4505-1ARJZ-R7; RoHS: Yes; Category: Amplifiers - Op Amps, Buffer, Instrumentation; Stock 1: 3416; Case/Package: SOT-23-5; Number of Pins: 5; Contact Plating: Tin,Matte; Min Operating Temperature: -40°C; Max Operating Temperature: 125°C; Bandwidth: 50kHz; Packaging: Tape and Reel; Package Quantity: 3000; Unity Gain Bandwidth Product: 50kHz; Number of Channels: 1; Number of Elements: 1; Number of Amplifiers: 1; Quiescent Current: 9uA; REACH SVHC: No SVHC; Lead Free: Contains Lead; ComponentLink1URL: https://datasheet.ciiva.com/22712/1610797-22712032.pdf?src-supplier=Element14; ComponentLink1Description: https://datasheet.ciiva.com/22712/1610797-22712032.pdf?src-supplier=Element14; ComponentLink2URL: https://datasheet.ciiva.com/23805/608874-23805844.pdf?src-supplier=Newark; ComponentLink2Description: https://datasheet.ciiva.com/23805/608874-23805844.pdf?src-supplier=Newark; ComponentLink3URL: https://datasheet.ciiva.com/1487/1610797-1487372.pdf?src-supplier=Element14; ComponentLink3Description: https://datasheet.ciiva.com/1487/1610797-1487372.pdf?src-supplier=Element14; Digikey: ADA4505-1ARJZ-R7CT-ND
U4-U7 = OP AMP DUAL: IC OPAMP VFB 50KHZ RRO 8MSOP; Manufacturer: Analog Devices; Manufacturer Part Number: ADA4505-2ARMZ; Common Mode Rejection Ratio: 105dB; Max Supply Voltage: 5V; Min Supply Voltage: 1.8V; Max Dual Supply Voltage: 2.5V; Min Dual Supply Voltage: 900mV; Voltage Gain: 120dB; Operating Supply Voltage: 3V; Slew Rate: 0.006V/µs; Input Offset Voltage (Vos): 3mV; Input Bias Current: 0.5pA; Operating Supply Current: 14uA; Number of Channels: 2; Power Supply Rejection Ratio (PSRR): 110dB; Output Current per Channel: 40mA; Quiescent Current: 7uA; Input Capacitance: 4.7pF; Supply Type: Single,Dual; RoHS: Yes; Category: Amplifiers - Op Amps, Buffer, Instrumentation; Stock 1: 767; Case/Package: MSOP; Number of Pins: 8; Contact Plating: Tin,Matte; Min Operating Temperature: -40°C; Max Operating Temperature: 125°C; Gain Bandwidth Product: 50kHz; Packaging: Rail/Tube; Package Quantity: 50; Unity Gain Bandwidth Product: 50kHz; Number of Circuits: 2; Number of Elements: 2; Number of Amplifiers: 2; Max Input Voltage: 5V; Nominal Supply Current: 7uA; Bandwidth: 50kHz; Length: 3.2mm; Width: 3.2mm; Height: 0.95mm; Lead Free: Contains Lead; REACH SVHC: No SVHC; ComponentLink1URL: https://datasheet.ciiva.com/24017/ada4505-1-4505-2-4505-4-249280-24017665.pdf?src-supplier=Mouser; ComponentLink1Description: https://datasheet.ciiva.com/24017/ada4505-1-4505-2-4505-4-249280-24017665.pdf?src-supplier=Mouser; ComponentLink2URL: https://datasheet.ciiva.com/2974/ada4505-1-4505-2-4505-4-2974772.pdf?src-supplier=Avnet; ComponentLink2Description: https://datasheet.ciiva.com/2974/ada4505-1-4505-2-4505-4-2974772.pdf?src-supplier=Avnet; ComponentLink3URL: https://datasheet.ciiva.com/17569/ada4505-1-4505-2-4505-4-17569270.pdf?src-supplier=Avnet+Europe; ComponentLink3Description: https://datasheet.ciiva.com/17569/ada4505-1-4505-2-4505-4-17569270.pdf?src-supplier=Avnet+Europe; ComponentLink4URL: https://datasheet.ciiva.com/1805/ada4505-1-4505-2-4505-4-1805784.pdf?src-supplier=Digi-Key; ComponentLink4Description: https://datasheet.ciiva.com/1805/ada4505-1-4505-2-4505-4-1805784.pdf?src-supplier=Digi-Key; Digikey: ADA4505-2ARMZ-ND

## Sheet Mainboard_RMII_Interface.SchDoc
size A4
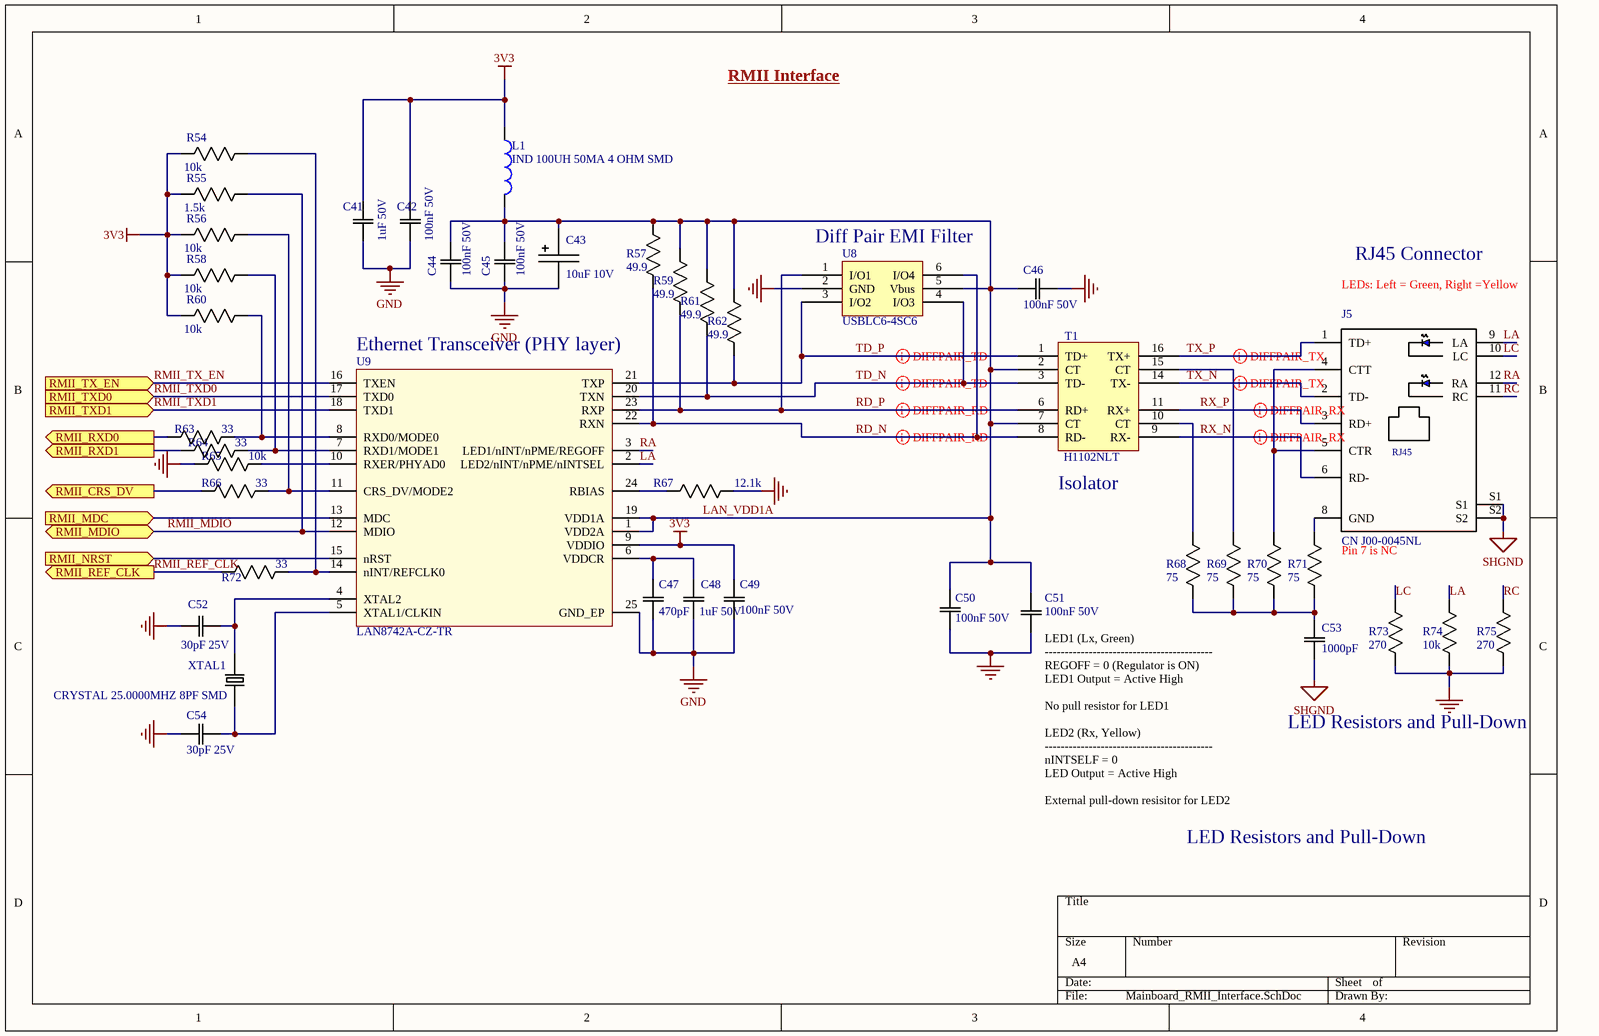
[diagram p2: Mainboard_RMII_Interface.SchDoc]

### Parts
C41  1uF 50V  [0805]
C42  100nF 50V  [0805]
C43  10uF 10V  [1206 Polarized]
C44  100nF 50V  [0805]
C45  100nF 50V  [0805]
C46  100nF 50V  [0805]
C47  470pF  [0805]
C48  1uF 50V  [0805]
C49  100nF 50V  [0805]
C50  100nF 50V  [0805]
C51  100nF 50V  [0805]
C52  30pF 25V  [0805]
C53  1000pF  [0805]
C54  30pF 25V  [0805]
J5  CN J00-0045NL  [RJ45 J00-0045NL]
L1  IND 100UH 50MA 4 OHM SMD  [0805]
R54  10k  [0805]
R55  1.5k  [0805]
R56  10k  [0805]
R57  49.9  [0805]
R58  10k  [0805]
R59  49.9  [0805]
R60  10k  [0805]
R61  49.9  [0805]
R62  49.9  [0805]
R63  33  [0805]
R64  33  [0805]
R65  10k  [0805]
R66  33  [0805]
R67  12.1k  [0805]
R68  75  [0805]
R69  75  [0805]
R70  75  [0805]
R71  75  [0805]
R72  33  [0805]
R73  270  [0805]
R74  10k  [0805]
R75  270  [0805]
T1  H1102NLT  [TRANSFORMER]
U8  USBLC6-4SC6  [SOT23-6L]
U9  LAN8742A-CZ-TR  [24-QFN (4x4)]
XTAL1  CRYSTAL 25.0000MHZ 8PF SMD  [SMD-2]

### Ports
RMII_CRS_DV (out), RMII_MDC (in), RMII_MDIO (bidir), RMII_NRST (in), RMII_REF_CLK (out), RMII_RXD0 (out), RMII_RXD1 (out), RMII_TX_EN (in), RMII_TXD0 (in), RMII_TXD1 (in)

### Nets
3V3: C41.2(C2) C42.2(C2) C49.2(C2) L1.1 R54.2(R2) R55.2(R2) R56.2(R2) R58.2(R2) R60.2(R2) U9.9(VDDIO)
GND: C41.1(C1) C42.1(C1) C43.2(P$2) C44.1(C1) C45.1(C1) C46.2(C2) C47.1(C1) C48.1(C1) C49.1(C1) C50.1(C1) C51.1(C1) C52.1(C1) C54.1(C1) R65.2(R2) R67.1(R1) R73.2(R2) R74.2(R2) R75.2(R2) U8.2(GND) U9.25(GND_EP)
SHGND: C53.1(C1) J5.S1 J5.S2
LA: J5.9(LA) R74.1(R1) U9.2(LED2/nINT/nPME/nINTSEL)
LAN_VDD1A: C43.1(P$1) C44.2(C2) C45.2(C2) C46.1(C1) C50.2(C2) C51.2(C2) L1.2 R57.1(R1) R59.1(R1) R61.1(R1) R62.1(R1) T1.2(CT) T1.7(CT) U8.5(Vbus) U9.1(VDD2A) U9.19(VDD1A)
LC: J5.10(LC) R73.1(R1)
RA: J5.12(RA) U9.3(LED1/nINT/nPME/REGOFF)
RC: J5.11(RC) R75.1(R1)
RD_N: R57.2(R2) T1.8(RD-) U8.6(I/O4) U9.22(RXN)
RD_P: R59.2(R2) T1.6(RD+) U8.1(I/O1) U9.23(RXP)
RMII_MDIO: R55.1(R1) U9.12(MDIO) ; port RMII_MDIO
RMII_REF_CLK: R72.2(R2) ; port RMII_REF_CLK
RMII_TX_EN: U9.16(TXEN) ; port RMII_TX_EN
RMII_TXD0: U9.17(TXD0) ; port RMII_TXD0
RMII_TXD1: U9.18(TXD1) ; port RMII_TXD1
RX_N: J5.6(RD-) T1.9(RX-)
RX_P: J5.3(RD+) T1.11(RX+)
TD_N: R61.2(R2) T1.3(TD-) U8.4(I/O3) U9.20(TXN)
TD_P: R62.2(R2) T1.1(TD+) U8.3(I/O2) U9.21(TXP)
TX_N: J5.2(TD-) T1.14(TX-)
TX_P: J5.1(TD+) T1.16(TX+)
NetC47_2: C47.2(C2) C48.2(C2) U9.6(VDDCR)
NetC52_2: C52.2(C2) U9.4(XTAL2) XTAL1.2
NetC53_2: C53.2(C2) R68.2(R2) R69.2(R2) R70.2(R2) R71.2(R2)
NetC54_2: C54.2(C2) U9.5(XTAL1/CLKIN) XTAL1.1
NetJ5_4: J5.4(CTT) J5.5(CTR) R70.1(R1)
NetJ5_8: J5.8(GND) R71.1(R1)
NetR54_1: R54.1(R1) R72.1(R1) U9.14(nINT/REFCLK0)
NetR56_1: R56.1(R1) R66.1(R1) U9.11(CRS_DV/MODE2)
NetR58_1: R58.1(R1) R64.1(R1) U9.7(RXD1/MODE1)
NetR60_1: R60.1(R1) R63.1(R1) U9.8(RXD0/MODE0)
NetR63_2: R63.2(R2) ; port RMII_RXD0
NetR64_2: R64.2(R2) ; port RMII_RXD1
NetR65_1: R65.1(R1) U9.10(RXER/PHYAD0)
NetR66_2: R66.2(R2) ; port RMII_CRS_DV
NetR67_2: R67.2(R2) U9.24(RBIAS)
NetR68_1: R68.1(R1) T1.10(CT)
NetR69_1: R69.1(R1) T1.15(CT)
NetU9_13: U9.13(MDC) ; port RMII_MDC
NetU9_15: U9.15(nRST) ; port RMII_NRST

### Layout directives
differential pair: RD_N, RD_P, RX_N, RX_P, TD_N, TD_P, TX_N, TX_P

### Notes on the sheet
- RMII Interface
- (near U8) Diff Pair EMI Filter
- (near J5) LEDs: Left = Green, Right =Yellow
- RJ45 Connector
- Ethernet Transceiver (PHY layer)
- (near T1) Isolator
- Pin 7 is NC
- LED Resistors and Pull-Down
- (near C51) LED1 (Lx, Green)
  ------------------------------------------
  REGOFF = 0 (Regulator is ON)
  LED1 Output = Active High
  No pull resistor for LED1
  LED2 (Rx, Yellow)
  ------------------------------------------
  nINTSELF = 0
  LED Output = Active High
  External pull-down resisitor for LED2
- (in symbol CN MAGJACK) RJ45

### Library data of the parts
C41 C48 = CAP 1uF 50V: CAP CER 1UF 50V X7R 0805; Tolerance: 10%; Package: 0805; Value: 1uF; Rating: 50V; Temperature Coefficient: X7R; Operating Temperature: -55°C ~ 125°C
C42 C44-C46 C49-C51 = CAP 100nF 50V: as C27 on sheet Mainboard_Encoder_Interface; Package: 0805; Value: 100nF; Rating: 50V
C43 = CAP TANT 10uF 10V: CAP TANT 10UF 10V 1206; Tolerance: 10%; ESR (Equivalent Series Resistance): 3.8 Ohm; Type: Molded Tantalum; Package: 1206; Value: 10uF; Rating: 10V; Operating Temperature: -55°C ~ 125°C
C47 = CAP 470pF 50V: CAP CER 470PF 50V X7R 0603/0805; Tolerance: 10%; Package: 0603/0805; Value: 470pF; Rating: 50V; Temperature Coefficient: X7R; Operating Temperature: -55°C ~ 125°C
C52 C54 = CAP 30pF 25V: CAP CER 30PF 25V NP0 0805; Tolerance: 20%; Package: 0805; Value: 30pF; Rating: 25V
C53 = CAP 1000pF 50V: CAP CER 1000PF 50V X7R 0603/0805; Tolerance: 10%; Package: 0603/0805; Value: 1000pF; Rating: 50V; Temperature Coefficient: X7R; Operating Temperature: -55°C ~ 125°C
J5 = CN MAGJACK: CN MAGJACK 1PORT 100 BASE-TX; MF: Pulse Electronics; Package: None; SnapEDA_Link: https://www.snapeda.com/parts/J00-0045NL/Pulse%20Electronics%20Network/view-part/87956/?ref=snap; MP: J00-0045NL; Value: *; Digikey Link: https://www.digikey.com/product-detail/en/pulse-electronics-network/J00-0045NL/553-1619-5-ND/1036860?utm_source=snapeda&utm_medium=aggregator&utm_campaign=symbol; Digikey: 553-1619-5-ND; Supplier 1: Mouser; Supplier Part Number 1: 673-J00-0045NL
L1 = IND 100UH 50MA 4 OHM SMD: 100µH Unshielded Wirewound Inductor 50mA 4Ohm 0805 (2012 Metric); MF: Taiyo Yuden; MP: LBR2012T101K; Revision: July-2002: Re-released for DXP Platform.; Value: 100uH; Digikey: 587-2048-1-ND; Digikey Link: https://www.digikey.ca/product-detail/en/taiyo-yuden/LBR2012T101K/587-2048-1-ND/1788995; Supplier 1: Digi-Key; Supplier Part Number 1: 587-4040-1-ND
R54 R56 R58 R60 R65 R74 = RES 10k 1/8W - 1%: RES SMD 10K OHM 1% 1/8W 0805; Power (Watts): 0.125W; Package: 0805; Value: 10k; Tolerance: 1%
R55 = RES 1.5k 1/8W - 1%: RES SMD 1.5K OHM 1% 1/8W 0805; Power (Watts): 0.125W; Package: 0805; Value: 1.5k; Tolerance: 1%; ComponentLink1Description: digikey; ComponentLink1URL: https://www.digikey.ca/en/products/detail/panasonic-electronic-components/ERJ-6ENF1022V/111476
R57 R59 R61 R62 = RES 49.9 1/8W: RES SMD 49.9 OHM 1% 1/8W 0805; Power (Watts): 0.125W; Package: 0805; Value: 49.9; Tolerance: 1%
R63 R64 R66 R72 = RES 33.0 1/8W - 1%: RES SMD 33 OHM 1% 1/8W 0805; Power (Watts): 0.125W; Package: 0805; Value: 33; Tolerance: 1%
R67 = RES 12.1k 1/8W: RES SMD 12.1K OHM 1% 1/8W 0805; Power (Watts): 0.125W; Package: 0805; Value: 12.1k; Tolerance: 1%
R68-R71 = RES 75.0 1/8W - 1%: RES SMD 75 OHM 1% 1/8W 0805; Power (Watts): 0.125W; Package: 0805; Value: 75; Tolerance: 1%
R73 R75 = RES 270.0 1/8W: RES SMD 270 OHM 5% 1/8W 0805; Power (Watts): 0.125W; Package: 0805; Value: 270; Tolerance: 5%
T1 = XFRMR H1102NLT: Isolation and Data Interface (Encapsulated) Pulse Transformer 1:1 Transmitter, 1:1 Receiver Surface Mount; MF: Pulse Electronics; Package: SOIC-16; Price: 7.99 CAD; MP: H1102NL; Digikey: 553-1323-5-ND; Digikey Link: https://www.digikey.ca/en/products/detail/pulse-electronics-network/H1102NL/1036940?s=N4IgTCBcDaIBIEYEAYwDkAyIC6BfIA; Supplier 1: Digi-Key; Supplier Part Number 1: 553-1323-5-ND
U9 = LAN8742A-CZ-TR: LAN8742A-CZ-TR - Small Footprint RMII 10/100 Ethernet, Transceiver with HP Auto-MDIX and flexPWR Technology SQFN-24; MF: Microchip Technology; MP: LAN8742A-CZ-TR; Digikey: LAN8742A-CZ-CT-ND; Digikey Link: https://www.digikey.ca/product-detail/en/microchip-technology/LAN8742A-CZ-TR/LAN8742A-CZ-CT-ND/8256089; Supplier 1: Digi-Key; Supplier Part Number 1: LAN8742A-CZ-CT-ND
XTAL1 = XTAL 25MHZ 8PF SMD: 25MHz ±50ppm Crystal 8pF 70 Ohms 2-SMD, No Lead; MP: NX5032GA-25.000000MHZ-LN-CD-1; MF: NDK America, Inc.; ESR: 70 Ohms; Package: 2-SMD, No Lead; Price: 0.95 CAD; Frequency: 25MHz; Digikey: 644-1041-1-ND; Digikey Link: https://www.digikey.ca/product-detail/en/ndk-america-inc/NX5032GA-25.000000MHZ-LN-CD-1/644-1041-1-ND/1128913; Load Capacitance: 8pF; Supplier 1: Digi-Key; Supplier Part Number 1: 644-1041-1-ND

## Sheet Mainboard_MCU_Breakout.SchDoc
size A4
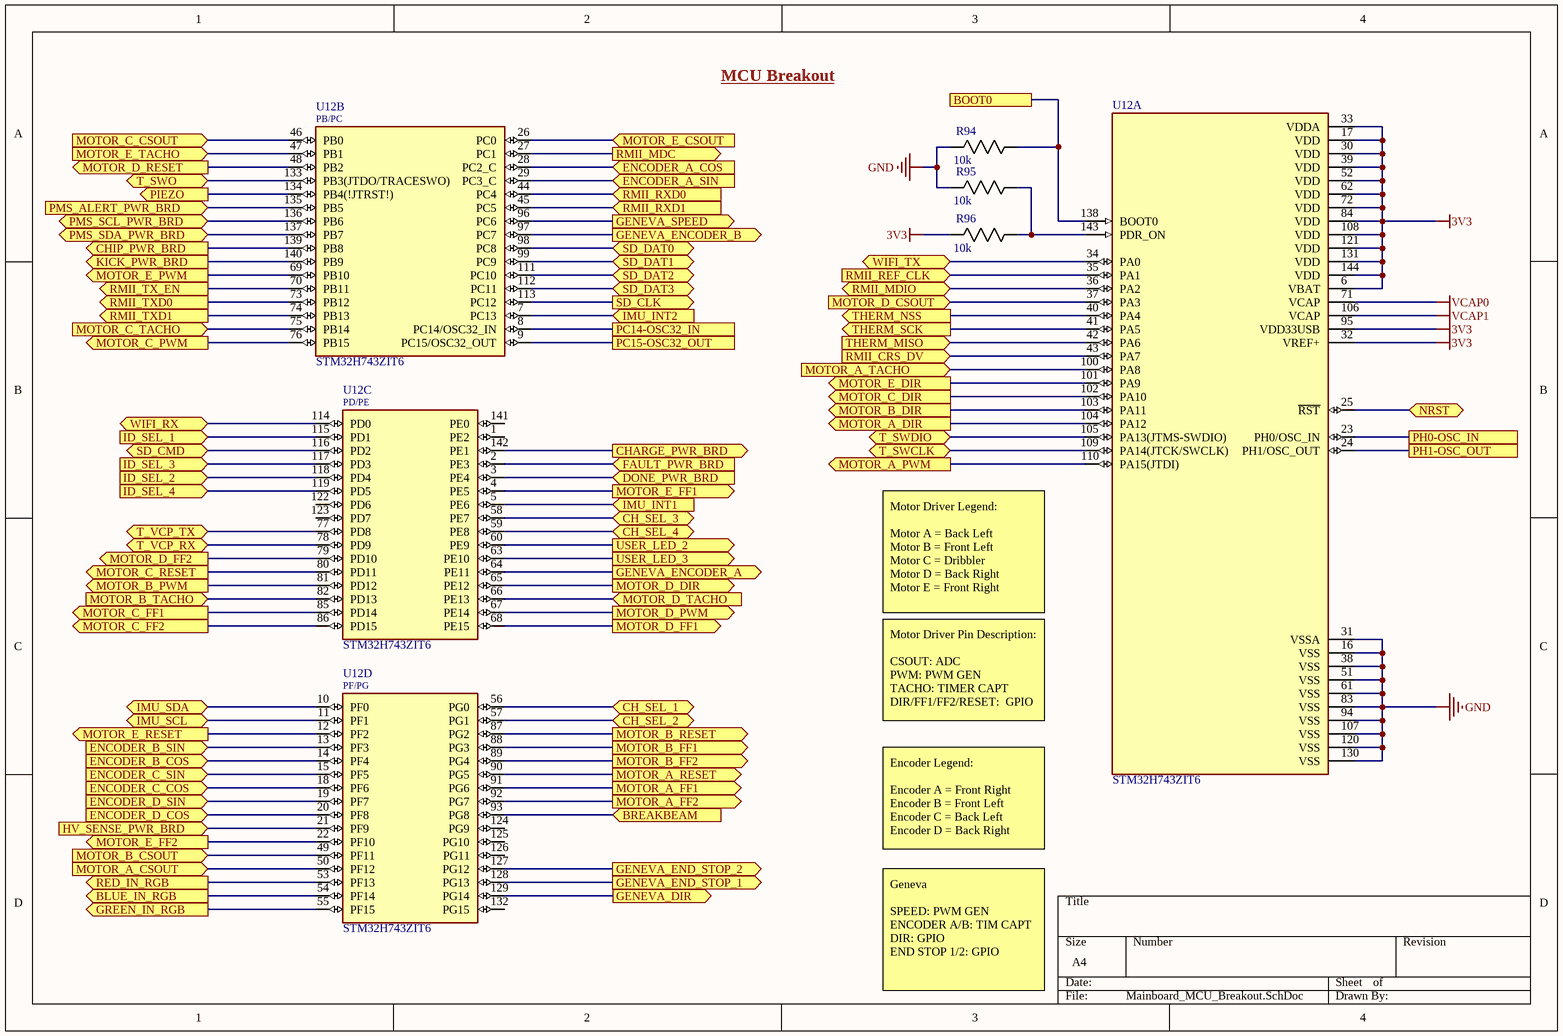
[diagram p3: Mainboard_MCU_Breakout.SchDoc]

### Parts
R94  10k  [0805]
R95  10k  [0805]
R96  10k  [0805]
U12  STM32H743ZIT6  [QFP50P2200X2200X160-144N]  (parts A,B,C,D of 4)

### Ports
BLUE_IN_RGB (out), BOOT0, BREAKBEAM (in), CH_SEL_1 (bidir), CH_SEL_2 (bidir), CH_SEL_3 (bidir), CH_SEL_4 (bidir), CHARGE_PWR_BRD (out), CHIP_PWR_BRD (out), DONE_PWR_BRD (in), ENCODER_A_COS (in), ENCODER_A_SIN (in), ENCODER_B_COS (in), ENCODER_B_SIN (in), ENCODER_C_COS (in), ENCODER_C_SIN (in), ENCODER_D_COS (in), ENCODER_D_SIN (in), FAULT_PWR_BRD (in), GENEVA_DIR (out), GENEVA_ENCODER_A (out), GENEVA_ENCODER_B (out), GENEVA_END_STOP_1 (out), GENEVA_END_STOP_2 (out), GENEVA_SPEED (out), GREEN_IN_RGB (out), HV_SENSE_PWR_BRD (in), ID_SEL_1 (in), ID_SEL_2 (in), ID_SEL_3 (in), ID_SEL_4 (in), IMU_INT1 (in), IMU_INT2 (in), IMU_SCL (bidir), IMU_SDA (bidir), KICK_PWR_BRD (out), MOTOR_A_CSOUT (in), MOTOR_A_DIR (out), MOTOR_A_FF1 (out), MOTOR_A_FF2 (out), MOTOR_A_PWM (out), MOTOR_A_RESET (out), MOTOR_A_TACHO (in), MOTOR_B_CSOUT (in), MOTOR_B_DIR (out), MOTOR_B_FF1 (out), MOTOR_B_FF2 (out), MOTOR_B_PWM (out), MOTOR_B_RESET (out), MOTOR_B_TACHO (in), MOTOR_C_CSOUT (in), MOTOR_C_DIR (out), MOTOR_C_FF1 (out), MOTOR_C_FF2 (out), MOTOR_C_PWM (out), MOTOR_C_RESET (out), MOTOR_C_TACHO (in), MOTOR_D_CSOUT (in), MOTOR_D_DIR (out), MOTOR_D_FF1 (out), MOTOR_D_FF2 (out), MOTOR_D_PWM (out), MOTOR_D_RESET (out), MOTOR_D_TACHO (in), MOTOR_E_CSOUT (in), MOTOR_E_DIR (out), MOTOR_E_FF1 (out), MOTOR_E_FF2 (out), MOTOR_E_PWM (out), MOTOR_E_RESET (out), MOTOR_E_TACHO (in), NRST (bidir), PC14-OSC32_IN, PC15-OSC32_OUT, PH0-OSC_IN, PH1-OSC_OUT, PIEZO (out), PMS_ALERT_PWR_BRD (in), PMS_SCL_PWR_BRD (bidir), PMS_SDA_PWR_BRD (bidir), RED_IN_RGB (out), RMII_CRS_DV (in), RMII_MDC (out), RMII_MDIO (bidir), RMII_REF_CLK (in), RMII_RXD0 (in), RMII_RXD1 (in), RMII_TX_EN (out), RMII_TXD0 (out), RMII_TXD1 (out), SD_CLK (out), SD_CMD (bidir), SD_DAT0 (bidir), SD_DAT1 (bidir), SD_DAT2 (bidir), SD_DAT3 (bidir), T_SWCLK (bidir), T_SWDIO (bidir), T_SWO (bidir), T_VCP_RX (bidir), T_VCP_TX (bidir), THERM_MISO (in), THERM_NSS (out), THERM_SCK (out), USER_LED_2 (out), USER_LED_3 (out), WIFI_RX (bidir), WIFI_TX (bidir)

### Nets
3V3: R96.2(R2) U12.6(VBAT) U12.17(VDD) U12.30(VDD) U12.32(VREF+) U12.33(VDDA) U12.39(VDD) U12.52(VDD) U12.62(VDD) U12.72(VDD) U12.84(VDD) U12.95(VDD33USB) U12.108(VDD) U12.121(VDD) U12.131(VDD) U12.144(VDD)
GND: R94.2(R2) R95.2(R2) U12.16(VSS) U12.31(VSSA) U12.38(VSS) U12.51(VSS) U12.61(VSS) U12.83(VSS) U12.94(VSS) U12.107(VSS) U12.120(VSS) U12.130(VSS)
VCAP0: U12.71(VCAP)
VCAP1: U12.106(VCAP)
COS_A: U12.28(PC2_C) ; port ENCODER_A_COS
COS_B: U12.14(PF4) ; port ENCODER_B_COS
COS_C: U12.18(PF6) ; port ENCODER_C_COS
COS_D: U12.20(PF8) ; port ENCODER_D_COS
RMII_MDIO: U12.36(PA2) ; port RMII_MDIO
RMII_REF_CLK: U12.35(PA1) ; port RMII_REF_CLK
RMII_TX_EN: U12.70(PB11) ; port RMII_TX_EN
RMII_TXD0: U12.73(PB12) ; port RMII_TXD0
RMII_TXD1: U12.74(PB13) ; port RMII_TXD1
SIN_A: U12.29(PC3_C) ; port ENCODER_A_SIN
SIN_B: U12.13(PF3) ; port ENCODER_B_SIN
SIN_C: U12.15(PF5) ; port ENCODER_C_SIN
SIN_D: U12.19(PF7) ; port ENCODER_D_SIN
NetPboot1_1: R94.1(R1) U12.138(BOOT0) ; port BOOT0
NetR63_2: U12.44(PC4) ; port RMII_RXD0
NetR64_2: U12.45(PC5) ; port RMII_RXD1
NetR66_2: U12.43(PA7) ; port RMII_CRS_DV
NetR95_1: R95.1(R1) R96.1(R1) U12.143(PDR_ON)
NetU9_13: U12.27(PC1) ; port RMII_MDC
NetU9_15: U12.25(~{RST}) ; port NRST
NetU12_2: U12.2(PE3) ; port FAULT_PWR_BRD
NetU12_3: U12.3(PE4) ; port DONE_PWR_BRD
NetU12_4: U12.4(PE5) ; port MOTOR_E_FF1
NetU12_5: U12.5(PE6) ; port IMU_INT1
NetU12_7: U12.7(PC13) ; port IMU_INT2
NetU12_8: U12.8(PC14/OSC32_IN) ; port PC14-OSC32_IN
NetU12_9: U12.9(PC15/OSC32_OUT) ; port PC15-OSC32_OUT
NetU12_10: U12.10(PF0) ; port IMU_SDA
NetU12_11: U12.11(PF1) ; port IMU_SCL
NetU12_12: U12.12(PF2) ; port MOTOR_E_RESET
NetU12_21: U12.21(PF9) ; port HV_SENSE_PWR_BRD
NetU12_22: U12.22(PF10) ; port MOTOR_E_FF2
NetU12_23: U12.23(PH0/OSC_IN) ; port PH0-OSC_IN
NetU12_24: U12.24(PH1/OSC_OUT) ; port PH1-OSC_OUT
NetU12_26: U12.26(PC0) ; port MOTOR_E_CSOUT
NetU12_34: U12.34(PA0) ; port WIFI_TX
NetU12_37: U12.37(PA3) ; port MOTOR_D_CSOUT
NetU12_40: U12.40(PA4) ; port THERM_NSS
NetU12_41: U12.41(PA5) ; port THERM_SCK
NetU12_42: U12.42(PA6) ; port THERM_MISO
NetU12_46: U12.46(PB0) ; port MOTOR_C_CSOUT
NetU12_47: U12.47(PB1) ; port MOTOR_E_TACHO
NetU12_48: U12.48(PB2) ; port MOTOR_D_RESET
NetU12_49: U12.49(PF11) ; port MOTOR_B_CSOUT
NetU12_50: U12.50(PF12) ; port MOTOR_A_CSOUT
NetU12_53: U12.53(PF13) ; port RED_IN_RGB
NetU12_54: U12.54(PF14) ; port BLUE_IN_RGB
NetU12_55: U12.55(PF15) ; port GREEN_IN_RGB
NetU12_56: U12.56(PG0) ; port CH_SEL_1
NetU12_57: U12.57(PG1) ; port CH_SEL_2
NetU12_58: U12.58(PE7) ; port CH_SEL_3
NetU12_59: U12.59(PE8) ; port CH_SEL_4
NetU12_60: U12.60(PE9) ; port USER_LED_2
NetU12_63: U12.63(PE10) ; port USER_LED_3
NetU12_64: U12.64(PE11) ; port GENEVA_ENCODER_A
NetU12_65: U12.65(PE12) ; port MOTOR_D_DIR
NetU12_66: U12.66(PE13) ; port MOTOR_D_TACHO
NetU12_67: U12.67(PE14) ; port MOTOR_D_PWM
NetU12_68: U12.68(PE15) ; port MOTOR_D_FF1
NetU12_69: U12.69(PB10) ; port MOTOR_E_PWM
NetU12_75: U12.75(PB14) ; port MOTOR_C_TACHO
NetU12_76: U12.76(PB15) ; port MOTOR_C_PWM
NetU12_77: U12.77(PD8) ; port T_VCP_TX
NetU12_78: U12.78(PD9) ; port T_VCP_RX
NetU12_79: U12.79(PD10) ; port MOTOR_D_FF2
NetU12_80: U12.80(PD11) ; port MOTOR_C_RESET
NetU12_81: U12.81(PD12) ; port MOTOR_B_PWM
NetU12_82: U12.82(PD13) ; port MOTOR_B_TACHO
NetU12_85: U12.85(PD14) ; port MOTOR_C_FF1
NetU12_86: U12.86(PD15) ; port MOTOR_C_FF2
NetU12_87: U12.87(PG2) ; port MOTOR_B_RESET
NetU12_88: U12.88(PG3) ; port MOTOR_B_FF1
NetU12_89: U12.89(PG4) ; port MOTOR_B_FF2
NetU12_90: U12.90(PG5) ; port MOTOR_A_RESET
NetU12_91: U12.91(PG6) ; port MOTOR_A_FF1
NetU12_92: U12.92(PG7) ; port MOTOR_A_FF2
NetU12_93: U12.93(PG8) ; port BREAKBEAM
NetU12_96: U12.96(PC6) ; port GENEVA_SPEED
NetU12_97: U12.97(PC7) ; port GENEVA_ENCODER_B
NetU12_98: U12.98(PC8) ; port SD_DAT0
NetU12_99: U12.99(PC9) ; port SD_DAT1
NetU12_100: U12.100(PA8) ; port MOTOR_A_TACHO
NetU12_101: U12.101(PA9) ; port MOTOR_E_DIR
NetU12_102: U12.102(PA10) ; port MOTOR_C_DIR
NetU12_103: U12.103(PA11) ; port MOTOR_B_DIR
NetU12_104: U12.104(PA12) ; port MOTOR_A_DIR
NetU12_105: U12.105(PA13(JTMS-SWDIO)) ; port T_SWDIO
NetU12_109: U12.109(PA14(JTCK/SWCLK)) ; port T_SWCLK
NetU12_110: U12.110(PA15(JTDI)) ; port MOTOR_A_PWM
NetU12_111: U12.111(PC10) ; port SD_DAT2
NetU12_112: U12.112(PC11) ; port SD_DAT3
NetU12_113: U12.113(PC12) ; port SD_CLK
NetU12_114: U12.114(PD0) ; port WIFI_RX
NetU12_115: U12.115(PD1) ; port ID_SEL_1
NetU12_116: U12.116(PD2) ; port SD_CMD
NetU12_117: U12.117(PD3) ; port ID_SEL_3
NetU12_118: U12.118(PD4) ; port ID_SEL_2
NetU12_119: U12.119(PD5) ; port ID_SEL_4
NetU12_127: U12.127(PG12) ; port GENEVA_END_STOP_2
NetU12_128: U12.128(PG13) ; port GENEVA_END_STOP_1
NetU12_129: U12.129(PG14) ; port GENEVA_DIR
NetU12_133: U12.133(PB3(JTDO/TRACESWO)) ; port T_SWO
NetU12_134: U12.134(PB4(!JTRST!)) ; port PIEZO
NetU12_135: U12.135(PB5) ; port PMS_ALERT_PWR_BRD
NetU12_136: U12.136(PB6) ; port PMS_SCL_PWR_BRD
NetU12_137: U12.137(PB7) ; port PMS_SDA_PWR_BRD
NetU12_139: U12.139(PB8) ; port CHIP_PWR_BRD
NetU12_140: U12.140(PB9) ; port KICK_PWR_BRD
NetU12_142: U12.142(PE1) ; port CHARGE_PWR_BRD

Not connected (* = marked no-connect by the designer): U12 1(PE2) 122(PD6) 123(PD7) 124(PG9) 125(PG10) 126(PG11) 132(PG15) 141(PE0)

### Notes on the sheet
- MCU Breakout
- Motor Driver Legend:
  Motor A = Back Left
  Motor B = Front Left
  Motor C = Dribbler
  Motor D = Back Right
  Motor E = Front Right
- Motor Driver Pin Description:
  CSOUT: ADC
  PWM: PWM GEN
  TACHO: TIMER CAPT
  DIR/FF1/FF2/RESET:  GPIO
- Encoder Legend:
  Encoder A = Front Right
  Encoder B = Front Left
  Encoder C = Back Left
  Encoder D = Back Right
- Geneva
  SPEED: PWM GEN
  ENCODER A/B: TIM CAPT
  DIR: GPIO
  END STOP 1/2: GPIO
- (in symbol STM32H743ZIT6, part B) PB/PC
- (in symbol STM32H743ZIT6, part C) PD/PE
- (in symbol STM32H743ZIT6, part D) PF/PG

### Library data of the parts
R94-R96 = RES 10k 1/8W - 1%: as R54 on sheet Mainboard_RMII_Interface; Package: 0805; Value: 10k; Tolerance: 1%
U12 = STM32H743ZIT6: ARM® Cortex®-M7 STM32H7 Microcontroller IC 32-Bit 480MHz 2MB (2M x 8) FLASH 144-LQFP (20x20); MF: STMicroelectronics; Package: LQFP-144 STMicroelectronics; MP: STM32H743ZIT6; ComponentLink1Description: SnapEDA; ComponentLink1URL: https://www.snapeda.com/parts/STM32H743ZIT6/STMicroelectronics/view-part/1041111/?ref=snap; ComponentLink2Description: DigiKey; ComponentLink2URL: https://www.digikey.ca/en/products/detail/stmicroelectronics/STM32H743ZIT6/7809238; ComponentLink3Description: Datasheet; ComponentLink3URL: https://www.st.com/resource/en/datasheet/stm32h743bi.pdf; Digikey: 497-17721-ND

## Nets that join several sheets
3V3: Mainboard_Encoder_Interface (16 pins), Mainboard_RMII_Interface (10 pins), Mainboard_MCU_Breakout (16 pins)
GND: Mainboard_Encoder_Interface (24 pins), Mainboard_RMII_Interface (20 pins), Mainboard_MCU_Breakout (12 pins)
COS_A: Mainboard_Encoder_Interface (R9.1 U5.1), Mainboard_MCU_Breakout (U12.28)
COS_B: Mainboard_Encoder_Interface (R35.1 U7.1), Mainboard_MCU_Breakout (U12.14)
COS_C: Mainboard_Encoder_Interface (R6.1 U4.1), Mainboard_MCU_Breakout (U12.18)
COS_D: Mainboard_Encoder_Interface (R30.1 U6.1), Mainboard_MCU_Breakout (U12.20)
NetPboot1_1: MainBoard_Top (Pboot1.1 Pboot1.2), Mainboard_MCU_Breakout (R94.1 U12.138)
NetR63_2: Mainboard_RMII_Interface (R63.2), Mainboard_MCU_Breakout (U12.44)
NetR64_2: Mainboard_RMII_Interface (R64.2), Mainboard_MCU_Breakout (U12.45)
NetR66_2: Mainboard_RMII_Interface (R66.2), Mainboard_MCU_Breakout (U12.43)
NetU9_13: Mainboard_RMII_Interface (U9.13), Mainboard_MCU_Breakout (U12.27)
NetU9_15: Mainboard_RMII_Interface (U9.15), Mainboard_MCU_Breakout (U12.25)
RMII_MDIO: Mainboard_RMII_Interface (R55.1 U9.12), Mainboard_MCU_Breakout (U12.36)
RMII_REF_CLK: Mainboard_RMII_Interface (R72.2), Mainboard_MCU_Breakout (U12.35)
RMII_TX_EN: Mainboard_RMII_Interface (U9.16), Mainboard_MCU_Breakout (U12.70)
RMII_TXD0: Mainboard_RMII_Interface (U9.17), Mainboard_MCU_Breakout (U12.73)
RMII_TXD1: Mainboard_RMII_Interface (U9.18), Mainboard_MCU_Breakout (U12.74)
SIN_A: Mainboard_Encoder_Interface (R19.1 U5.7), Mainboard_MCU_Breakout (U12.29)
SIN_B: Mainboard_Encoder_Interface (R45.1 U7.7), Mainboard_MCU_Breakout (U12.13)
SIN_C: Mainboard_Encoder_Interface (R14.1 U4.7), Mainboard_MCU_Breakout (U12.15)
SIN_D: Mainboard_Encoder_Interface (R38.1 U6.7), Mainboard_MCU_Breakout (U12.19)